# Altium project 3Phase_Power_Meter.PrjPcb
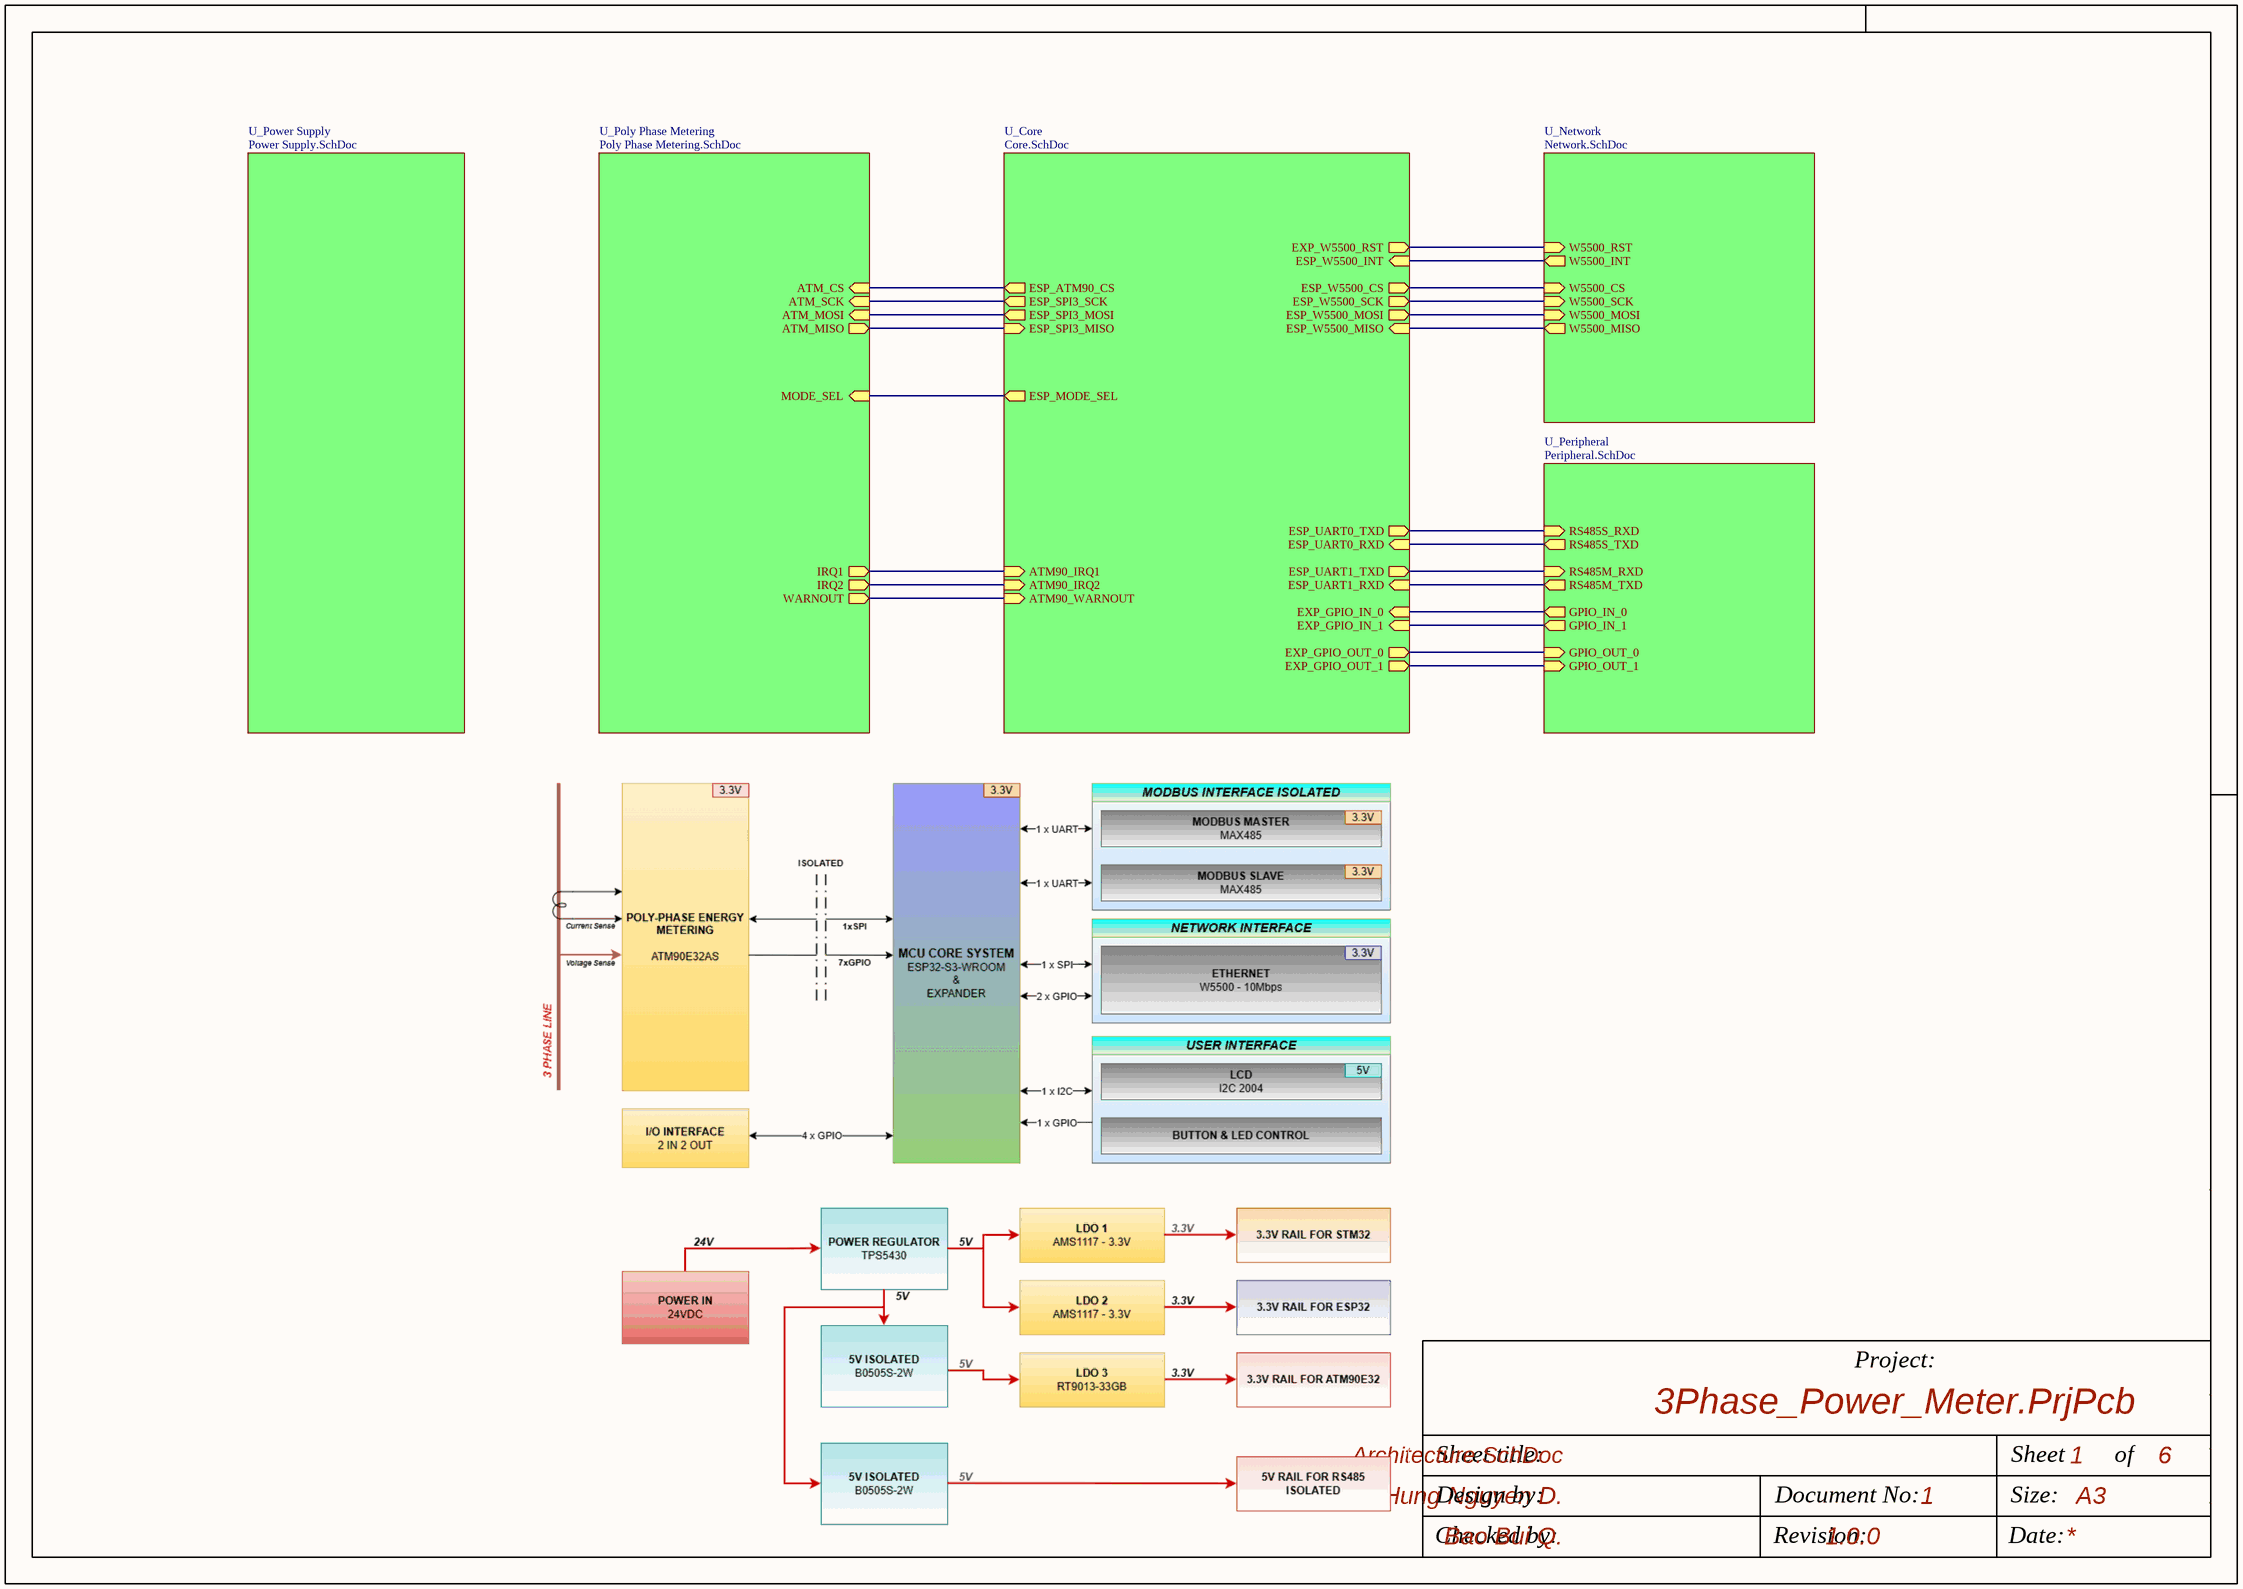
[diagram p0: Architecture.SchDoc]
6 sheets, 303 parts. Net scope: hierarchical (ports join the sheet entries above them; power ports are global).
Board file: PCB.PcbDoc
Sheets:
  Architecture.SchDoc
    U_Network = Network.SchDoc
    U_Peripheral = Peripheral.SchDoc
    U_Poly Phase Metering = Poly Phase Metering.SchDoc
    U_Power Supply = Power Supply.SchDoc
    U_Core = Core.SchDoc

## Sheet Architecture.SchDoc
size 420 x 297 mm; CheckedBy: Bao Bui Q.; Engineer: Hung Nguyen D.; Revision: 1.0.0; SheetNumber: 1; SheetTotal: 6

### Sub-sheets
U_Core = Core.SchDoc: ESP_SPI3_SCK (out), ESP_SPI3_MOSI (out), ESP_W5500_CS (out), ESP_SPI3_MISO (in), ESP_UART0_TXD (out), ESP_ATM90_CS (out), ESP_UART0_RXD (in), ESP_UART1_TXD (out), ESP_UART1_RXD (in), EXP_W5500_RST (out), ESP_W5500_INT (in), EXP_GPIO_IN_0 (in), EXP_GPIO_IN_1 (in), EXP_GPIO_OUT_0 (out), EXP_GPIO_OUT_1 (out), ATM90_IRQ1 (in), ATM90_IRQ2 (in), ATM90_WARNOUT (in), ESP_W5500_MISO (in), ESP_W5500_MOSI (out), ESP_W5500_SCK (out), ESP_MODE_SEL (out)
U_Network = Network.SchDoc: W5500_RST (in), W5500_INT (out), W5500_SCK (in), W5500_MOSI (in), W5500_MISO (out), W5500_CS (in)
U_Peripheral = Peripheral.SchDoc: RS485M_RXD (in), RS485M_TXD (out), RS485S_RXD (in), RS485S_TXD (out), GPIO_IN_0 (out), GPIO_OUT_0 (in), GPIO_IN_1 (out), GPIO_OUT_1 (in)
U_Poly Phase Metering = Poly Phase Metering.SchDoc: IRQ1 (out), IRQ2 (out), WARNOUT (out), ATM_CS (in), ATM_SCK (in), ATM_MOSI (in), ATM_MISO (out), MODE_SEL (in)
U_Power Supply = Power Supply.SchDoc: no entries

### Nets
ESP_SPI3_MISO: sheet U_Poly Phase Metering/ATM_MISO, sheet U_Core/ESP_SPI3_MISO
ESP_SPI3_MOSI: sheet U_Poly Phase Metering/ATM_MOSI, sheet U_Core/ESP_SPI3_MOSI
ESP_SPI3_SCK: sheet U_Poly Phase Metering/ATM_SCK, sheet U_Core/ESP_SPI3_SCK
W5500_RST: sheet U_Network/W5500_RST, sheet U_Core/EXP_W5500_RST
NetQ1_1: sheet U_Poly Phase Metering/MODE_SEL, sheet U_Core/ESP_MODE_SEL
NetQ2_1: sheet U_Peripheral/GPIO_OUT_0, sheet U_Core/EXP_GPIO_OUT_0
NetQ3_1: sheet U_Peripheral/GPIO_OUT_1, sheet U_Core/EXP_GPIO_OUT_1
NetR61_1: sheet U_Poly Phase Metering/IRQ1, sheet U_Core/ATM90_IRQ1
NetR63_1: sheet U_Poly Phase Metering/IRQ2, sheet U_Core/ATM90_IRQ2
NetR65_1: sheet U_Poly Phase Metering/WARNOUT, sheet U_Core/ATM90_WARNOUT
NetR90_1: sheet U_Peripheral/RS485S_RXD, sheet U_Core/ESP_UART0_TXD
NetR92_1: sheet U_Peripheral/RS485S_TXD, sheet U_Core/ESP_UART0_RXD
NetR94_1: sheet U_Peripheral/RS485M_RXD, sheet U_Core/ESP_UART1_TXD
NetR95_1: sheet U_Peripheral/RS485M_TXD, sheet U_Core/ESP_UART1_RXD
NetR96_2: sheet U_Network/W5500_SCK, sheet U_Core/ESP_W5500_SCK
NetR97_2: sheet U_Network/W5500_MOSI, sheet U_Core/ESP_W5500_MOSI
NetR98_2: sheet U_Network/W5500_MISO, sheet U_Core/ESP_W5500_MISO
NetR99_2: sheet U_Network/W5500_CS, sheet U_Core/ESP_W5500_CS
NetR100_2: sheet U_Network/W5500_INT, sheet U_Core/ESP_W5500_INT
NetR123_1: sheet U_Peripheral/GPIO_IN_0, sheet U_Core/EXP_GPIO_IN_0
NetR126_1: sheet U_Peripheral/GPIO_IN_1, sheet U_Core/EXP_GPIO_IN_1
NetU5_31: sheet U_Poly Phase Metering/ATM_CS, sheet U_Core/ESP_ATM90_CS

### Notes on the sheet
- Project:
- Sheet title:
- Sheet
- of
- Design by:
- Document No:
- Size:
- A3
- Checked by:
- Revision:
- Date:

## Sheet Network.SchDoc
size 420 x 297 mm; CheckedBy: Bao Bui Q; Engineer: Hung Nguyen D.; Revision: 1.0.0; SheetNumber: 6; SheetTotal: 6
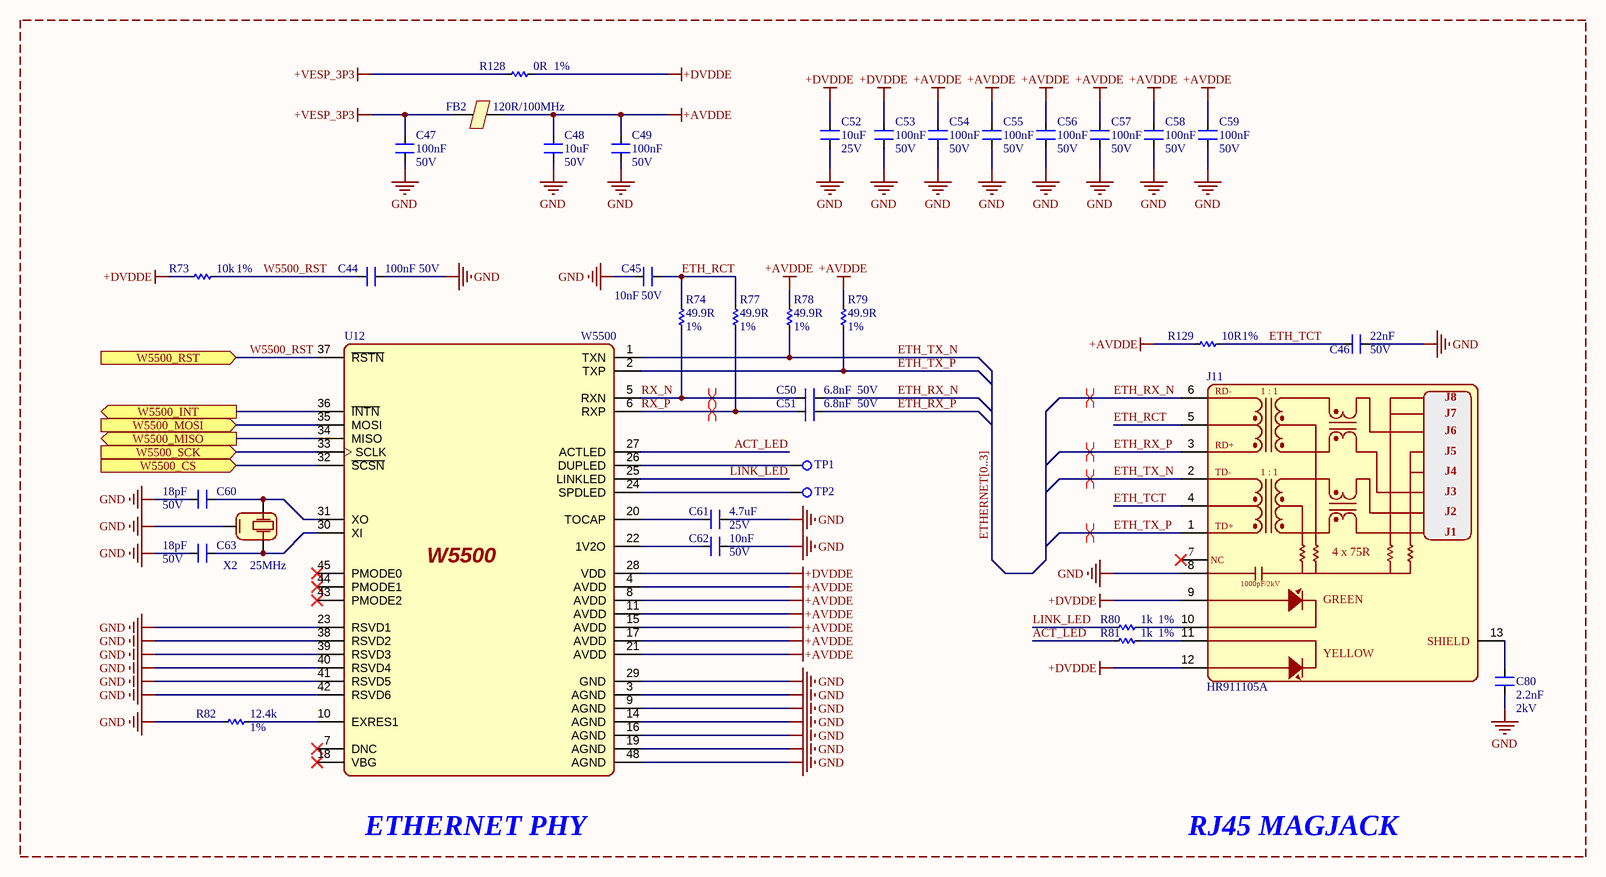
[diagram p1: Network.SchDoc]

### Parts
C44  Rating: 50V  [CAP_SMD_0603]  (hidden comment: 100nF)
C45  Rating: 50V  [CAP_SMD_0603]  (hidden comment: 10nF)
C46  Rating: 50V  [CAP_SMD_0603]  (hidden comment: 22nF)
C47  Rating: 50V  [CAP_SMD_0805]  (hidden comment: 100nF)
C48  Rating: 50V  [CAP_SMD_0603]  (hidden comment: 10uF)
C49  Rating: 50V  [CAP_SMD_0603]  (hidden comment: 100nF)
C50  Rating: 50V  [CAP_SMD_0603]  (hidden comment: 6.8nF)
C51  Rating: 50V  [CAP_SMD_0603]  (hidden comment: 6.8nF)
C52  Rating: 25V  [CAP_SMD_0805]  (hidden comment: 10uF)
C53  Rating: 50V  [CAP_SMD_0805]  (hidden comment: 100nF)
C54  Rating: 50V  [CAP_SMD_0603]  (hidden comment: 100nF)
C55  Rating: 50V  [CAP_SMD_0603]  (hidden comment: 100nF)
C56  Rating: 50V  [CAP_SMD_0603]  (hidden comment: 100nF)
C57  Rating: 50V  [CAP_SMD_0603]  (hidden comment: 100nF)
C58  Rating: 50V  [CAP_SMD_0603]  (hidden comment: 100nF)
C59  Rating: 50V  [CAP_SMD_0603]  (hidden comment: 100nF)
C60  Rating: 50V  [CAP_SMD_0805]  (hidden comment: 18pF)
C61  Rating: 25V  [CAP_SMD_0603]  (hidden comment: 4.7uF)
C62  Rating: 50V  [CAP_SMD_0603]  (hidden comment: 10nF)
C63  Rating: 50V  [CAP_SMD_0805]  (hidden comment: 18pF)
C80  Rating: 2kV  [CAP_SMD_1206]  (hidden comment: 2.2nF)
FB2  120R/100MHz  [Ferrite-0805]
J11  HR911105A  [HR911105A]
R73  Tolerance: 1%  [RES_SMD_0603]  (hidden comment: 10k)
R74  Tolerance: 1%  [RES_SMD_0603]  (hidden comment: 49.9R)
R77  Tolerance: 1%  [RES_SMD_0603]  (hidden comment: 49.9R)
R78  Tolerance: 1%  [RES_SMD_0603]  (hidden comment: 49.9R)
R79  Tolerance: 1%  [RES_SMD_0603]  (hidden comment: 49.9R)
R80  Tolerance: 1%  [RES_SMD_0603]  (hidden comment: 1k)
R81  Tolerance: 1%  [RES_SMD_0603]  (hidden comment: 1k)
R82  Tolerance: 1%  [RES_SMD_0603]  (hidden comment: 12.4k)
R128  Tolerance: 1%  [RES_SMD_0805]  (hidden comment: 0R)
R129  Tolerance: 1%  [RES_SMD_0603]  (hidden comment: 10R)
TP1  Test_Point  [PAD-SMD-D1.0]  (value not drawn)
TP2  Test_Point  [PAD-SMD-D1.0]  (value not drawn)
U12  W5500  [LQFP-48(7x7)]
X2  25MHz  [XT4-3225]

### Ports
W5500_CS (in, see Architecture[5A]), W5500_INT (out, see Architecture[5A]), W5500_MISO (out, see Architecture[5A]), W5500_MOSI (in, see Architecture[5A]), W5500_RST (in, see Architecture[5A]), W5500_SCK (in, see Architecture[5A])

### Nets
+AVDDE: C48.1 C49.1 C54.1 C55.1 C56.1 C57.1 C58.1 C59.1 FB2.2 R78.2 R79.2 R129.1 U12.4(AVDD) U12.8(AVDD) U12.11(AVDD) U12.15(AVDD) U12.17(AVDD) U12.21(AVDD)
+DVDDE: C52.1 C53.1 J11.9 J11.12 R73.1 R128.2 U12.28(VDD)
+VESP_3P3: C47.1 FB2.1 R128.1
GND: C44.1 C45.2 C46.1 C47.2 C48.2 C49.2 C52.2 C53.2 C54.2 C55.2 C56.2 C57.2 C58.2 C59.2 C60.2 C61.1 C62.1 C63.2 C80.2 J11.8 R82.2 U12.3(AGND) U12.9(AGND) U12.14(AGND) U12.16(AGND) U12.19(AGND) U12.23(RSVD1) U12.29(GND) U12.38(RSVD2) U12.39(RSVD3) U12.40(RSVD4) U12.41(RSVD5) U12.42(RSVD6) U12.48(AGND) X2.2,4(GND)
ACT_LED: R81.2 U12.27(ACTLED)
ETH_RCT: C45.1 J11.5 R74.2 R77.2
ETH_RX_N: C50.1 J11.6
ETH_RX_P: C51.1 J11.3
ETH_TCT: C46.2 J11.4 R129.2
ETH_TX_N: J11.2 R78.1 U12.1(TXN)
ETH_TX_P: J11.1 R79.1 U12.2(TXP)
LINK_LED: R80.2 U12.25(LINKLED)
RX_N: C50.2 R74.1 U12.5(RXN)
RX_P: C51.2 R77.1 U12.6(RXP)
W5500_RST: C44.2 R73.2 U12.37(~{RSTN}) ; port W5500_RST
NetC60_1: C60.1 U12.31(XO) X2.1(XTAL)
NetC61_2: C61.2 U12.20(TOCAP)
NetC62_2: C62.2 U12.22(1V2O)
NetC63_1: C63.1 U12.30(XI) X2.3(XTAL)
NetC80_1: C80.1 J11.13(SHIELD)
NetJ11_10: J11.10 R80.1
NetJ11_11: J11.11 R81.1
NetR82_1: R82.1 U12.10(EXRES1)
NetR96_2: U12.33(SCLK) ; port W5500_SCK
NetR97_2: U12.35(MOSI) ; port W5500_MOSI
NetR98_2: U12.34(MISO) ; port W5500_MISO
NetR99_2: U12.32(~{SCSN}) ; port W5500_CS
NetR100_2: U12.36(~{INTN}) ; port W5500_INT
NetTP1_1: TP1.1 U12.26(DUPLED)
NetTP2_1: TP2.1 U12.24(SPDLED)

Not connected (* = marked no-connect by the designer): J11 7(NC)*; U12 7(DNC)* 18(VBG)* 43(PMODE2)* 44(PMODE1)* 45(PMODE0)*

### Buses and harness runs
bus ETHERNET[0..3]

### Layout directives
differential pair; differential pair class ETH 100R: ETH_RX_N, ETH_RX_P, ETH_TX_N, ETH_TX_P, RX_N, RX_P

### Notes on the sheet
- (near U12) ETHERNET PHY
- RJ45 MAGJACK
- Project:
- Sheet title:
- Sheet
- of
- Design by:
- Document No:
- Size:
- A3
- Checked by:
- Revision:
- Date:
- (in symbol RJ45_10/100) RD-; 1 : 1; J8; J7; J6; RD+; J5; TD-; J4; J3; J2; TD+; J1; 4 x 75R; 1000pF/2kV; GREEN; YELLOW

### Library data of the parts
C44-C63 C80 = CN: PN: *; LCSC: *
  C44 C47 C49 C53-C59: Value: 100nF
  C45 C62: Value: 10nF
  C46: Value: 22nF
  C48 C52: Value: 10uF
  C50 C51: Value: 6.8nF
  C60 C63: Value: 18pF
  C61: Value: 4.7uF
  C80: Value: 2.2nF
FB2 = FERRITE BEAD: PN: CBW201209U121T; LCSC: C139186; Value: 120R/100MHz
J11 = RJ45_10/100: PN: HR911105A; LCSC: C12074; Value: HR911105A
R73 R74 R77-R82 R128 R129 = Res-SMD: Resistor; PN: *; LCSC: *
  R73: Value: 10k
  R74 R77-R79: Value: 49.9R
  R80 R81: Value: 1k
  R82: Value: 12.4k
  R128: Value: 0R
  R129: Value: 10R
U12 = W5500: -40℃~+85℃ 10BASE-T、100BASE-TX 3.3V 32KB 8 SPI SPI Yes LQFP-48(7x7) Ethernet Controllers ROHS; PN: W5500; LCSC: C32843; Value: W5500
X2 = XT4: Crystal, 16 MHz, -30 to 85 degC, 3.2 x 2.5 x 0.9 mm SMD; PN: *; LCSC: *; Value: 25MHz

## Sheet Peripheral.SchDoc
size 420 x 297 mm; CheckedBy: Bao Bui Q.; Engineer: Hung Nguyen D.; Revision: 1.0.0; SheetNumber: 5; SheetTotal: 6
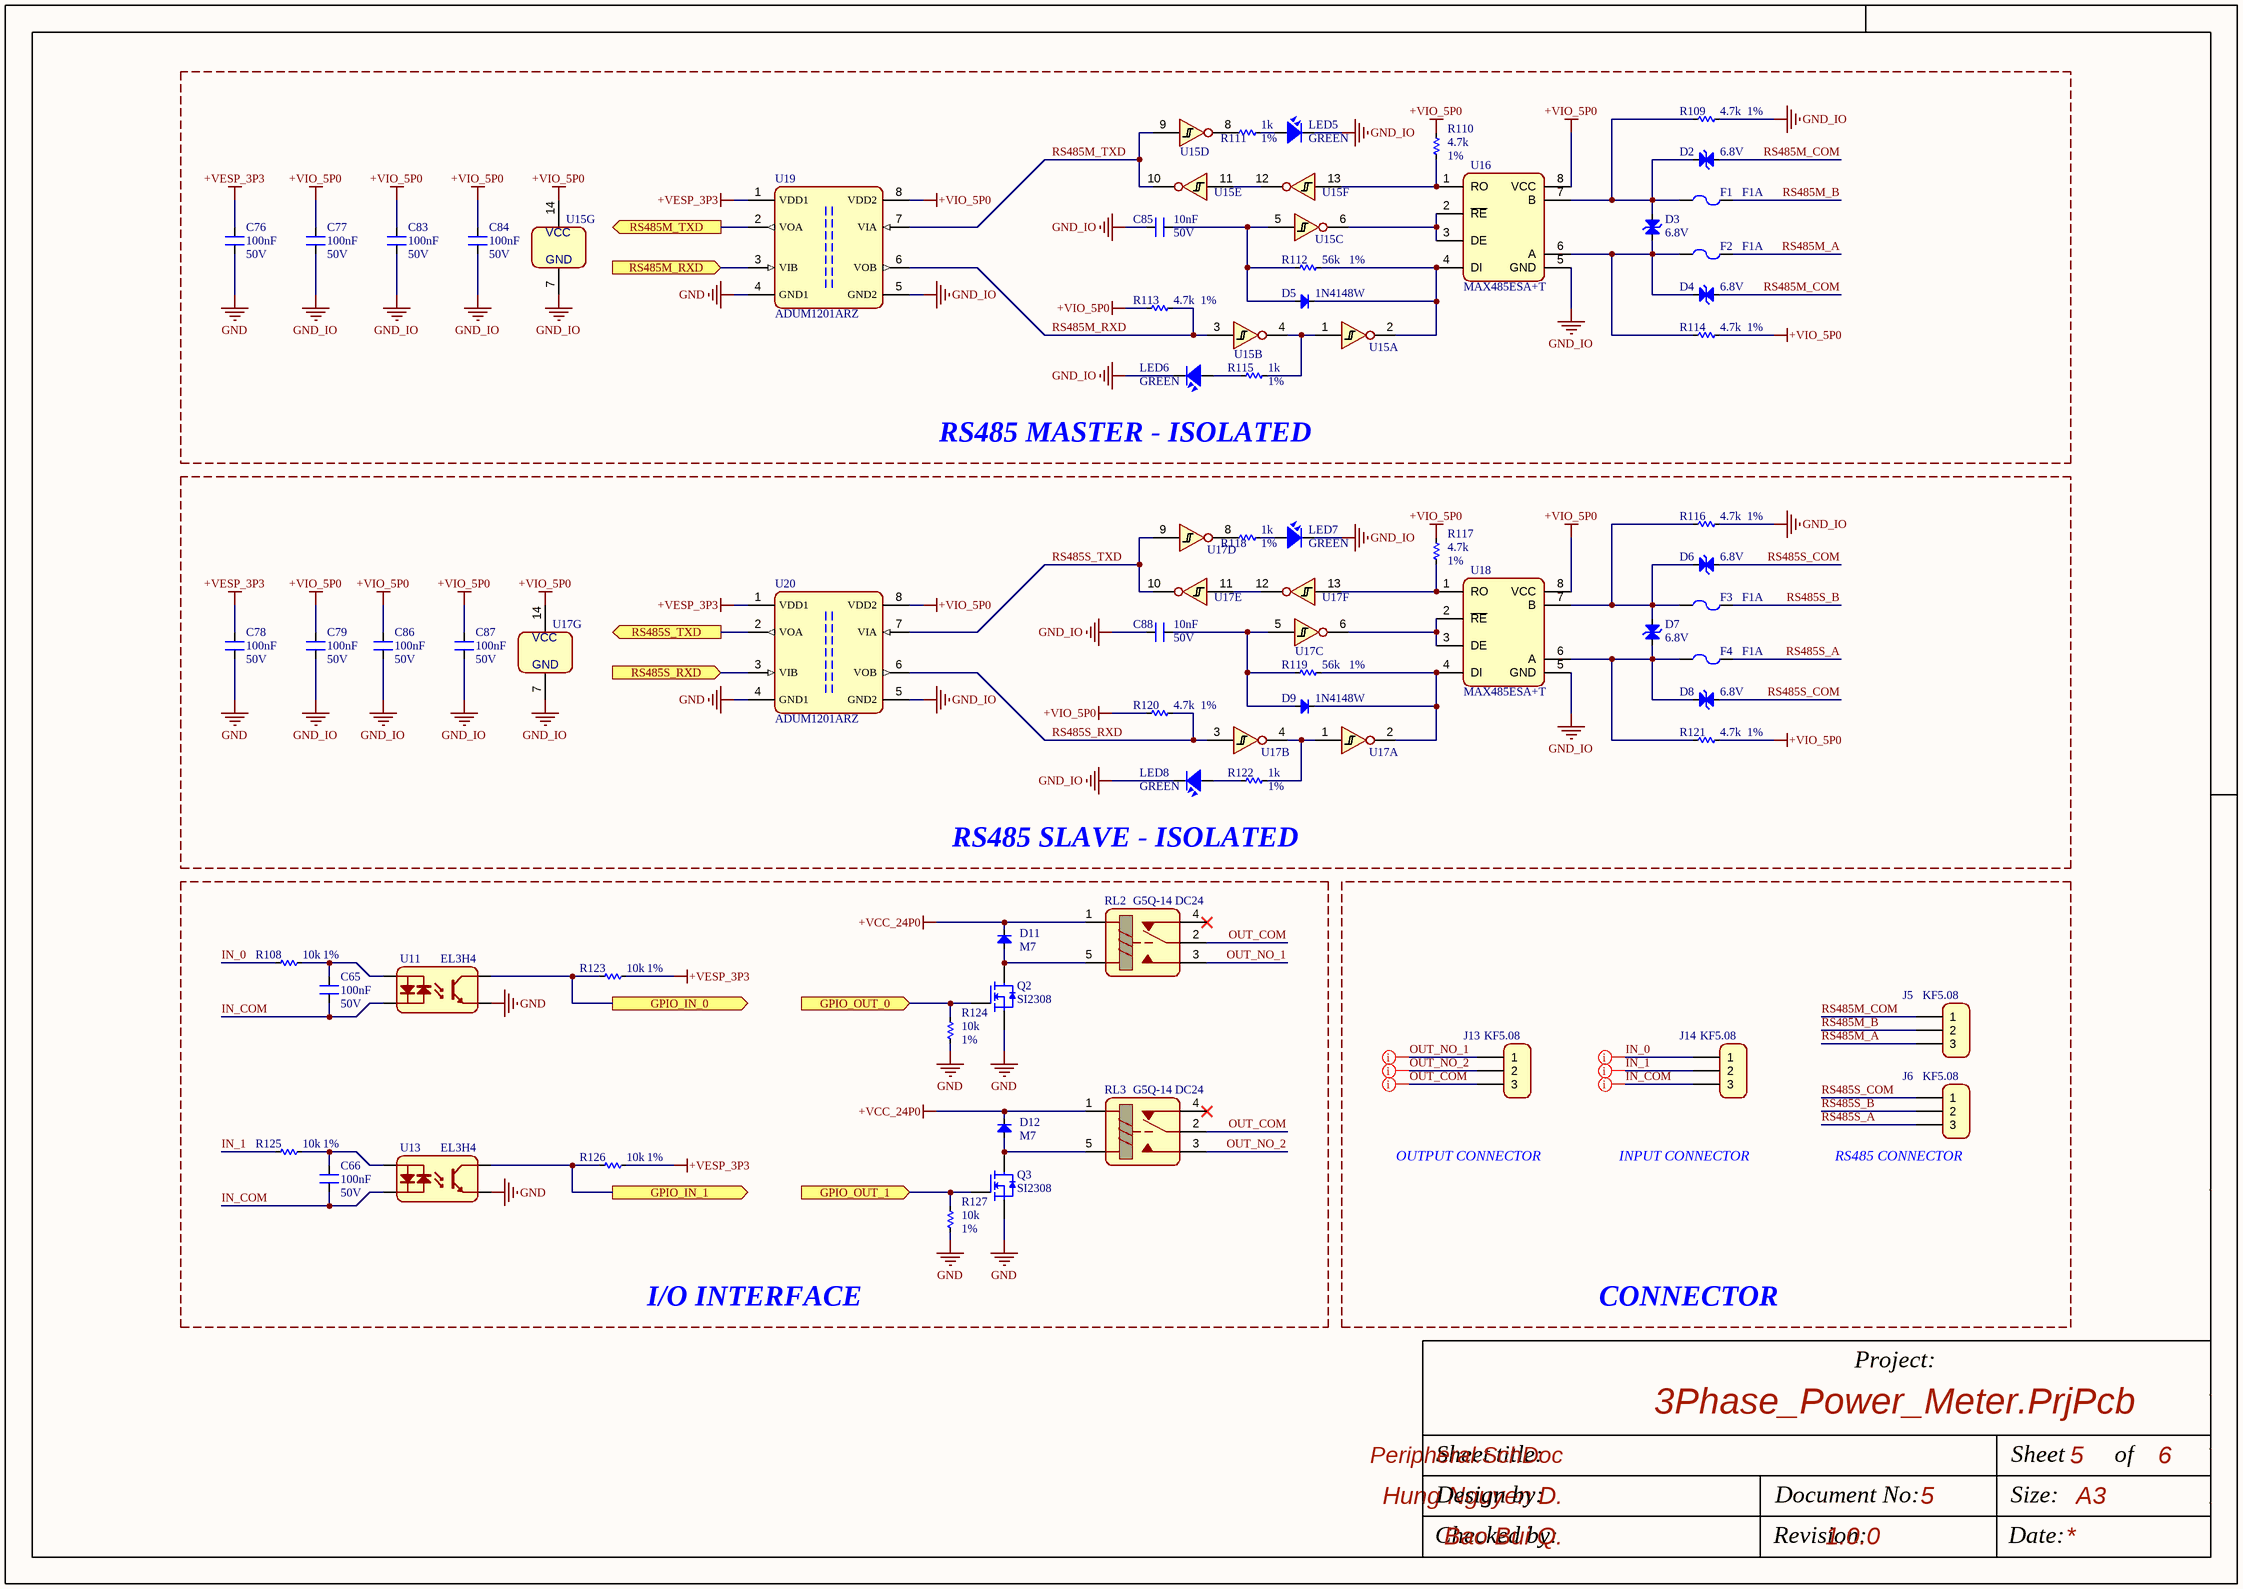
[diagram p2: Peripheral.SchDoc]

### Parts
C65  Rating: 50V  [CAP_SMD_0603]  (hidden comment: 100nF)
C66  Rating: 50V  [CAP_SMD_0603]  (hidden comment: 100nF)
C76  Rating: 50V  [CAP_SMD_0603]  (hidden comment: 100nF)
C77  Rating: 50V  [CAP_SMD_0603]  (hidden comment: 100nF)
C78  Rating: 50V  [CAP_SMD_0603]  (hidden comment: 100nF)
C79  Rating: 50V  [CAP_SMD_0603]  (hidden comment: 100nF)
C83  Rating: 50V  [CAP_SMD_0603]  (hidden comment: 100nF)
C84  Rating: 50V  [CAP_SMD_0603]  (hidden comment: 100nF)
C85  Rating: 50V  [CAP_SMD_0603]  (hidden comment: 10nF)
C86  Rating: 50V  [CAP_SMD_0603]  (hidden comment: 100nF)
C87  Rating: 50V  [CAP_SMD_0603]  (hidden comment: 100nF)
C88  Rating: 50V  [CAP_SMD_0603]  (hidden comment: 10nF)
D2  6.8V  [SOD123FL]
D3  6.8V  [SOD123FL]
D4  6.8V  [SOD123FL]
D5  1N4148W  [SOD323]
D6  6.8V  [SOD123FL]
D7  6.8V  [SOD123FL]
D8  6.8V  [SOD123FL]
D9  1N4148W  [SOD323]
D11  M7  [DIO-SMD-A]
D12  M7  [DIO-SMD-A]
F1  F1A  [FUSE_1812]
F2  F1A  [FUSE_1812]
F3  F1A  [FUSE_1812]
F4  F1A  [FUSE_1812]
J5  KF5.08  [KF3-5.08X]
J6  KF5.08  [KF3-5.08X]
J13  KF5.08  [KF3-5.08X]
J14  KF5.08  [KF3-5.08X]
LED5  GREEN  [GREENLED_0603]
LED6  GREEN  [GREENLED_0603]
LED7  GREEN  [GREENLED_0603]
LED8  GREEN  [GREENLED_0603]
Q2  SI2308  [SOT23-123]
Q3  SI2308  [SOT23-123]
R108  Tolerance: 1%  [RES_SMD_0603]  (hidden comment: 10k)
R109  Tolerance: 1%  [RES_SMD_0603]  (hidden comment: 4.7k)
R110  Tolerance: 1%  [RES_SMD_0603]  (hidden comment: 4.7k)
R111  Tolerance: 1%  [RES_SMD_0603]  (hidden comment: 1k)
R112  Tolerance: 1%  [RES_SMD_0603]  (hidden comment: 56k)
R113  Tolerance: 1%  [RES_SMD_0603]  (hidden comment: 4.7k)
R114  Tolerance: 1%  [RES_SMD_0603]  (hidden comment: 4.7k)
R115  Tolerance: 1%  [RES_SMD_0603]  (hidden comment: 1k)
R116  Tolerance: 1%  [RES_SMD_0603]  (hidden comment: 4.7k)
R117  Tolerance: 1%  [RES_SMD_0603]  (hidden comment: 4.7k)
R118  Tolerance: 1%  [RES_SMD_0603]  (hidden comment: 1k)
R119  Tolerance: 1%  [RES_SMD_0603]  (hidden comment: 56k)
R120  Tolerance: 1%  [RES_SMD_0603]  (hidden comment: 4.7k)
R121  Tolerance: 1%  [RES_SMD_0603]  (hidden comment: 4.7k)
R122  Tolerance: 1%  [RES_SMD_0603]  (hidden comment: 1k)
R123  Tolerance: 1%  [RES_SMD_0603]  (hidden comment: 10k)
R124  Tolerance: 1%  [RES_SMD_0603]  (hidden comment: 10k)
R125  Tolerance: 1%  [RES_SMD_0603]  (hidden comment: 10k)
R126  Tolerance: 1%  [RES_SMD_0603]  (hidden comment: 10k)
R127  Tolerance: 1%  [RES_SMD_0603]  (hidden comment: 10k)
RL2  G5Q-14 DC24  [RELAY-G5Q-14]
RL3  G5Q-14 DC24  [RELAY-G5Q-14]
U11  EL3H4  [SOIC-4-175mil]
U13  EL3H4  [SOIC-4-175mil]
U15  SN74HC14DR  [SOIC-14]  (value not drawn)  (parts A,B,C,D,E,F,G of 7)
U16  MAX485ESA+T  [SOIC-8]
U17  SN74HC14DR  [SOIC-14]  (value not drawn)  (parts A,B,C,D,E,F,G of 7)
U18  MAX485ESA+T  [SOIC-8]
U19  ADUM1201ARZ  [SOIC-8]
U20  ADUM1201ARZ  [SOIC-8]

### Blocks framed on the sheet
RS485 MASTER - ISOLATED: C76 C77 C83-C85 D2-D5 F1 F2 LED5 LED6 R109-R115 U15 U16 U19
RS485 SLAVE - ISOLATED: C78 C79 C86-C88 D6-D9 F3 F4 LED7 LED8 R116-R122 U17 U18 U20
I/O INTERFACE: C65 C66 D11 D12 Q2 Q3 R108 R123-R127 RL2 RL3 U11 U13
CONNECTOR: J5 J6 J13 J14

### Ports
GPIO_IN_0 (out, see Architecture[5B]), GPIO_IN_1 (out, see Architecture[5B]), GPIO_OUT_0 (in, see Architecture[5B]), GPIO_OUT_1 (in, see Architecture[5B]), RS485M_RXD (in, see Architecture[5B]), RS485M_TXD (out, see Architecture[5B]), RS485S_RXD (in, see Architecture[5B]), RS485S_TXD (out, see Architecture[5B])

### Nets
+VCC_24P0: D11.2(K) D12.2(K) RL2.1(COIL) RL3.1(COIL)
+VESP_3P3: C76.1 C78.1 R123.2 R126.2 U19.1(VDD1) U20.1(VDD1)
+VIO_5P0: C77.1 C79.1 C83.1 C84.1 C86.1 C87.1 R110.1 R113.2 R114.1 R117.1 R120.2 R121.1 U15.14(VCC) U16.8(VCC) U17.14(VCC) U18.8(VCC) U19.8(VDD2) U20.8(VDD2)
GND: C76.2 C78.2 Q2.2 Q3.2 R124.2 R127.2 U11.3(E) U13.3(E) U19.4(GND1) U20.4(GND1)
GND_IO: C77.2 C79.2 C83.2 C84.2 C85.2 C86.2 C87.2 C88.2 LED5.2 LED6.2 LED7.2 LED8.2 R109.1 R116.1 U15.7(GND) U16.5(GND) U17.7(GND) U18.5(GND) U19.5(GND2) U20.5(GND2)
IN_0: J14.1 R108.1
IN_1: J14.2 R125.1
IN_COM: C65.2 C66.2 J14.3 U11.2(AC) U13.2(AC)
OUT_COM: J13.3 RL2.2(COM) RL3.2(COM)
OUT_NO_1: J13.1 RL2.3
OUT_NO_2: J13.2 RL3.3
RS485M_A: F2.2 J5.3
RS485M_B: F1.2 J5.2
RS485M_COM: D2.2 D4.2 J5.1
RS485M_RXD: R113.1 U15.3(A) U19.6(VOB)
RS485M_TXD: U15.9(A) U15.10(Y) U19.7(VIA)
RS485S_A: F4.2 J6.3
RS485S_B: F3.2 J6.2
RS485S_COM: D6.2 D8.2 J6.1
RS485S_RXD: R120.1 U17.3(A) U20.6(VOB)
RS485S_TXD: U17.9(A) U17.10(Y) U20.7(VIA)
NetC65_1: C65.1 R108.2 U11.1(AC)
NetC66_1: C66.1 R125.2 U13.1(AC)
NetC85_1: C85.1 D5.1(A) R112.2 U15.5(A)
NetC88_1: C88.1 D9.1(A) R119.2 U17.5(A)
NetD2_1: D2.1 D3.1 F1.1 R109.2 U16.7(B)
NetD3_2: D3.2 D4.1 F2.1 R114.2 U16.6(A)
NetD5_2: D5.2(K) R112.1 U15.2(Y) U16.4(DI)
NetD6_1: D6.1 D7.1 F3.1 R116.2 U18.7(B)
NetD7_2: D7.2 D8.1 F4.1 R121.2 U18.6(A)
NetD9_2: D9.2(K) R119.1 U17.2(Y) U18.4(DI)
NetD11_1: D11.1(A) Q2.3 RL2.5(COIL)
NetD12_1: D12.1(A) Q3.3 RL3.5(COIL)
NetLED5_1: LED5.1 R111.2
NetLED6_1: LED6.1 R115.1
NetLED7_1: LED7.1 R118.2
NetLED8_1: LED8.1 R122.1
NetQ2_1: Q2.1 R124.1 ; port GPIO_OUT_0
NetQ3_1: Q3.1 R127.1 ; port GPIO_OUT_1
NetR90_1: U20.3(VIB) ; port RS485S_RXD
NetR92_1: U20.2(VOA) ; port RS485S_TXD
NetR94_1: U19.3(VIB) ; port RS485M_RXD
NetR95_1: U19.2(VOA) ; port RS485M_TXD
NetR110_2: R110.2 U15.13(A) U16.1(RO)
NetR111_1: R111.1 U15.8(Y)
NetR115_2: R115.2 U15.1(A) U15.4(Y)
NetR117_2: R117.2 U17.13(A) U18.1(RO)
NetR118_1: R118.1 U17.8(Y)
NetR122_2: R122.2 U17.1(A) U17.4(Y)
NetR123_1: R123.1 U11.4(C) ; port GPIO_IN_0
NetR126_1: R126.1 U13.4(C) ; port GPIO_IN_1
NetU15_6: U15.6(Y) U16.2(~{RE}) U16.3(DE)
NetU15_11: U15.11(A) U15.12(Y)
NetU17_6: U17.6(Y) U18.2(~{RE}) U18.3(DE)
NetU17_11: U17.11(A) U17.12(Y)

Not connected (* = marked no-connect by the designer): RL2 4(NC)*; RL3 4(NC)*

### Layout directives
net class HV_SIG: IN_0, IN_1, IN_COM, OUT_COM, OUT_NO_1, OUT_NO_2

### Notes on the sheet
- OUTPUT CONNECTOR
- INPUT CONNECTOR
- (near J6) RS485 CONNECTOR
- Project:
- Sheet title:
- Sheet
- of
- Design by:
- Document No:
- Size:
- A3
- Checked by:
- Revision:
- Date:

### Library data of the parts
C65 C66 C76-C79 C83-C88 = CN: PN: *; LCSC: *
  C65 C66 C76-C79 C83 C84 C86 C87: Value: 100nF
  C85 C88: Value: 10nF
D2-D4 D6-D8 = TVS DIODE: PN: *; LCSC: *; Value: 6.8V
D5 D9 D11 D12 = Diode SMD: Default Diode; LCSC: *; PN: *
  D5 D9: Value: 1N4148W
  D11 D12: Value: M7
F1-F4 = Fuse: Designed by: VanDungEvn; Value: Fuse
J5 J6 J13 J14 = KF3: ComponentLink1 Description: Manufacturer; ComponentLink2 Description: Datasheet; ComponentLink1URL: http://www.we-online.com; ComponentLink2URL: http://katalog.we-online.de/em/datasheet/6911031100xx.pdf; PN: *; LCSC: *; Value: KF5.08
LED5-LED8 = LED SMD: PN: *; LCSC: *; Value: GREEN
Q2 Q3 = FET-N: PN: *; LCSC: *; Value: SI2308
R108-R127 = Res-SMD: Resistor; PN: *; LCSC: *
  R108 R123-R127: Value: 10k
  R109 R110 R113 R114 R116 R117 R120 R121: Value: 4.7k
  R111 R115 R118 R122: Value: 1k
  R112 R119: Value: 56k
RL2 RL3 = Relay 5: Relay SPDT,10A - 12VDC 5 Pin; PN: G5Q-14 DC24; LCSC: C397242; Value: G5Q-14 DC24
U11 U13 = OPTO_AC: AC,DC Integrated anti-parallel LED Phototransistor; PN: EL3H4(A)(TA)-VG; LCSC: C42384997; Value: EL3H4
U15 U17 = 74HC14: -40℃~+85℃ 1 1.5V~4.2V 21ns@6V,50pF 2V~6V 2uA 300mV~1.2V 5.2mA 5.2mA 6 74HC Series Schmitt trigger SOIC-14 Inverters ROHS; Value: SN74HC14DR; PN: SN74HC14DR; LCSC: C6820
U16 U18 = MAX485: -40℃~+85℃ 1 1 2.5Mbps 4.75V~5.25V Transceiver SOIC-8 RS-485 / RS-422 ICs ROHS; PN: MAX485ESA+T; LCSC: C19738; Value: MAX485ESA+T
U19 U20 = ADUM1201: -40℃~+105℃ 1 1 1Mbps 2.7V~5.5V 2.7V~5.5V 2500 25kV/us 50ns Bidirectional signal isolation、Multi-voltage domain interface、Power-on reset SOIC-8 Digital Isolators ROHS; PN: ADUM1201ARZ; LCSC: C9669; Value: ADUM1201ARZ

## Sheet Poly Phase Metering.SchDoc
size 420 x 297 mm; CheckedBy: Bao Bui Q.; Engineer: Hung Nguyen D.; Revision: 1.0.0; SheetNumber: 3; SheetTotal: 6
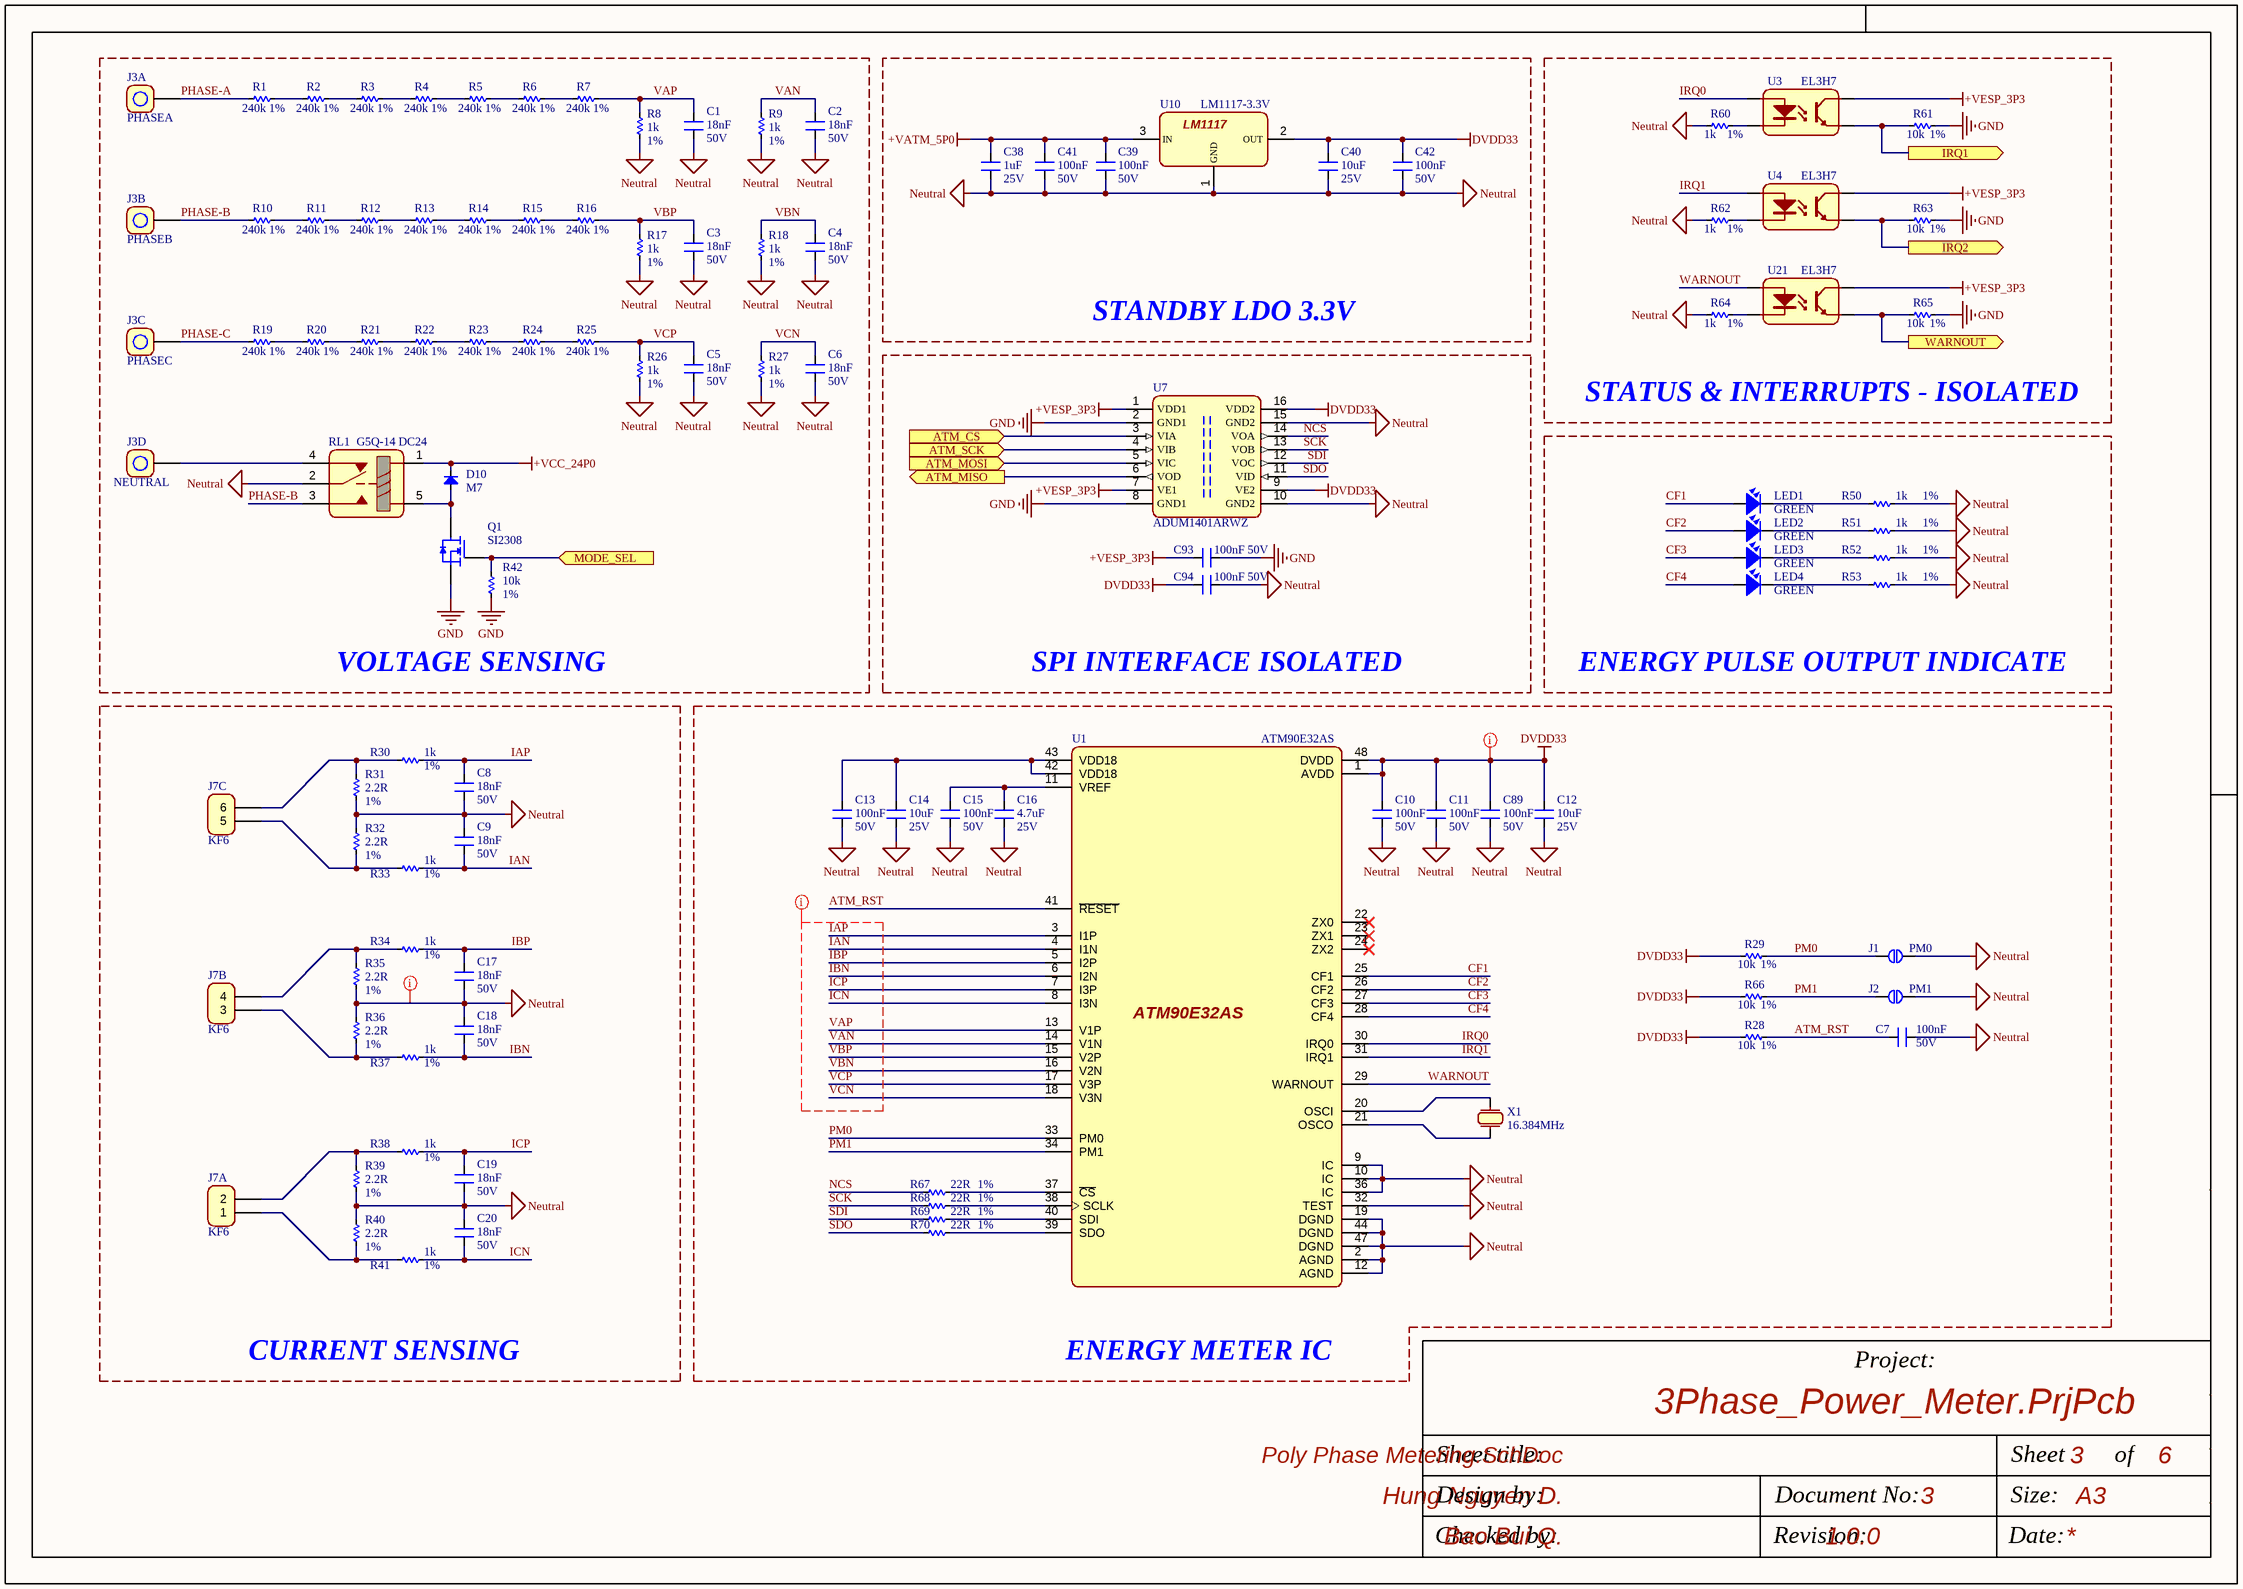
[diagram p3: Poly Phase Metering.SchDoc]

### Parts
C1  Rating: 50V  [CAP_SMD_0603]  (hidden comment: 18nF)
C2  Rating: 50V  [CAP_SMD_0603]  (hidden comment: 18nF)
C3  Rating: 50V  [CAP_SMD_0603]  (hidden comment: 18nF)
C4  Rating: 50V  [CAP_SMD_0603]  (hidden comment: 18nF)
C5  Rating: 50V  [CAP_SMD_0603]  (hidden comment: 18nF)
C6  Rating: 50V  [CAP_SMD_0603]  (hidden comment: 18nF)
C7  Rating: 50V  [CAP_SMD_0603]  (hidden comment: 100nF)
C8  Rating: 50V  [CAP_SMD_1206]  (hidden comment: 18nF)
C9  Rating: 50V  [CAP_SMD_1206]  (hidden comment: 18nF)
C10  Rating: 50V  [CAP_SMD_0603]  (hidden comment: 100nF)
C11  Rating: 50V  [CAP_SMD_0603]  (hidden comment: 100nF)
C12  Rating: 25V  [CAP_SMD_0603]  (hidden comment: 10uF)
C13  Rating: 50V  [CAP_SMD_0603]  (hidden comment: 100nF)
C14  Rating: 25V  [CAP_SMD_0603]  (hidden comment: 10uF)
C15  Rating: 50V  [CAP_SMD_0603]  (hidden comment: 100nF)
C16  Rating: 25V  [CAP_SMD_0603]  (hidden comment: 4.7uF)
C17  Rating: 50V  [CAP_SMD_1206]  (hidden comment: 18nF)
C18  Rating: 50V  [CAP_SMD_1206]  (hidden comment: 18nF)
C19  Rating: 50V  [CAP_SMD_1206]  (hidden comment: 18nF)
C20  Rating: 50V  [CAP_SMD_1206]  (hidden comment: 18nF)
C38  Rating: 25V  [CAP_SMD_1206]  (hidden comment: 1uF)
C39  Rating: 50V  [CAP_SMD_1206]  (hidden comment: 100nF)
C40  Rating: 25V  [CAP_SMD_1206]  (hidden comment: 10uF)
C41  Rating: 50V  [CAP_SMD_1206]  (hidden comment: 100nF)
C42  Rating: 50V  [CAP_SMD_1206]  (hidden comment: 100nF)
C89  Rating: 50V  [CAP_SMD_0603]  (hidden comment: 100nF)
C93  Rating: 50V  [CAP_SMD_0603]  (hidden comment: 100nF)
C94  Rating: 50V  [CAP_SMD_0603]  (hidden comment: 100nF)
D10  M7  [DIO-SMD-A]
J1  PM0  [SOLDER_JUMP_2_1mm]
J2  PM1  [SOLDER_JUMP_2_1mm]
J3  PHASEA  [KF7.62-7P]  (parts A,B,C,D of 4)
J7  KF6  [KF6-5.08X]  (parts A,B,C of 3)
LED1  GREEN  [GREENLED_0603]
LED2  GREEN  [GREENLED_0603]
LED3  GREEN  [GREENLED_0603]
LED4  GREEN  [GREENLED_0603]
Q1  SI2308  [SOT23-123]
R1  Tolerance: 1%  [RES_SMD_1206]  (hidden comment: 240k)
R2  Tolerance: 1%  [RES_SMD_1206]  (hidden comment: 240k)
R3  Tolerance: 1%  [RES_SMD_1206]  (hidden comment: 240k)
R4  Tolerance: 1%  [RES_SMD_1206]  (hidden comment: 240k)
R5  Tolerance: 1%  [RES_SMD_1206]  (hidden comment: 240k)
R6  Tolerance: 1%  [RES_SMD_1206]  (hidden comment: 240k)
R7  Tolerance: 1%  [RES_SMD_1206]  (hidden comment: 240k)
R8  Tolerance: 1%  [RES_SMD_0603]  (hidden comment: 1k)
R9  Tolerance: 1%  [RES_SMD_0603]  (hidden comment: 1k)
R10  Tolerance: 1%  [RES_SMD_1206]  (hidden comment: 240k)
R11  Tolerance: 1%  [RES_SMD_1206]  (hidden comment: 240k)
R12  Tolerance: 1%  [RES_SMD_1206]  (hidden comment: 240k)
R13  Tolerance: 1%  [RES_SMD_1206]  (hidden comment: 240k)
R14  Tolerance: 1%  [RES_SMD_1206]  (hidden comment: 240k)
R15  Tolerance: 1%  [RES_SMD_1206]  (hidden comment: 240k)
R16  Tolerance: 1%  [RES_SMD_1206]  (hidden comment: 240k)
R17  Tolerance: 1%  [RES_SMD_0603]  (hidden comment: 1k)
R18  Tolerance: 1%  [RES_SMD_0603]  (hidden comment: 1k)
R19  Tolerance: 1%  [RES_SMD_1206]  (hidden comment: 240k)
R20  Tolerance: 1%  [RES_SMD_1206]  (hidden comment: 240k)
R21  Tolerance: 1%  [RES_SMD_1206]  (hidden comment: 240k)
R22  Tolerance: 1%  [RES_SMD_1206]  (hidden comment: 240k)
R23  Tolerance: 1%  [RES_SMD_1206]  (hidden comment: 240k)
R24  Tolerance: 1%  [RES_SMD_1206]  (hidden comment: 240k)
R25  Tolerance: 1%  [RES_SMD_1206]  (hidden comment: 240k)
R26  Tolerance: 1%  [RES_SMD_0603]  (hidden comment: 1k)
R27  Tolerance: 1%  [RES_SMD_0603]  (hidden comment: 1k)
R28  Tolerance: 1%  [RES_SMD_0603]  (hidden comment: 10k)
R29  Tolerance: 1%  [RES_SMD_0603]  (hidden comment: 10k)
R30  Tolerance: 1%  [RES_SMD_1206]  (hidden comment: 1k)
R31  Tolerance: 1%  [RES_SMD_1206]  (hidden comment: 2.2R)
R32  Tolerance: 1%  [RES_SMD_1206]  (hidden comment: 2.2R)
R33  Tolerance: 1%  [RES_SMD_1206]  (hidden comment: 1k)
R34  Tolerance: 1%  [RES_SMD_1206]  (hidden comment: 1k)
R35  Tolerance: 1%  [RES_SMD_1206]  (hidden comment: 2.2R)
R36  Tolerance: 1%  [RES_SMD_1206]  (hidden comment: 2.2R)
R37  Tolerance: 1%  [RES_SMD_1206]  (hidden comment: 1k)
R38  Tolerance: 1%  [RES_SMD_1206]  (hidden comment: 1k)
R39  Tolerance: 1%  [RES_SMD_1206]  (hidden comment: 2.2R)
R40  Tolerance: 1%  [RES_SMD_1206]  (hidden comment: 2.2R)
R41  Tolerance: 1%  [RES_SMD_1206]  (hidden comment: 1k)
R42  Tolerance: 1%  [RES_SMD_0603]  (hidden comment: 10k)
R50  Tolerance: 1%  [RES_SMD_0603]  (hidden comment: 1k)
R51  Tolerance: 1%  [RES_SMD_0603]  (hidden comment: 1k)
R52  Tolerance: 1%  [RES_SMD_0603]  (hidden comment: 1k)
R53  Tolerance: 1%  [RES_SMD_0603]  (hidden comment: 1k)
R60  Tolerance: 1%  [RES_SMD_0603]  (hidden comment: 1k)
R61  Tolerance: 1%  [RES_SMD_0603]  (hidden comment: 10k)
R62  Tolerance: 1%  [RES_SMD_0603]  (hidden comment: 1k)
R63  Tolerance: 1%  [RES_SMD_0603]  (hidden comment: 10k)
R64  Tolerance: 1%  [RES_SMD_0603]  (hidden comment: 1k)
R65  Tolerance: 1%  [RES_SMD_0603]  (hidden comment: 10k)
R66  Tolerance: 1%  [RES_SMD_0603]  (hidden comment: 10k)
R67  Tolerance: 1%  [RES_SMD_0603]  (hidden comment: 22R)
R68  Tolerance: 1%  [RES_SMD_0603]  (hidden comment: 22R)
R69  Tolerance: 1%  [RES_SMD_0603]  (hidden comment: 22R)
R70  Tolerance: 1%  [RES_SMD_0603]  (hidden comment: 22R)
RL1  G5Q-14 DC24  [RELAY-G5Q-14]
U1  ATM90E32AS  [TQFP48]
U3  EL3H7  [SSOP-4-1.27mm]
U4  EL3H7  [SSOP-4-1.27mm]
U7  ADUM1401ARWZ  [SOIC-16-300mil]
U10  LM1117-3.3V  [SOT223-4]
U21  EL3H7  [SSOP-4-1.27mm]
X1  16.384MHz  [XT2-SMD]

### Blocks framed on the sheet
VOLTAGE SENSING: C1-C6 D10 J3 Q1 R1-R27 R42 RL1
STANDBY LDO 3.3V: C38-C42 U10
STATUS & INTERRUPTS - ISOLATED: R60-R65 U3 U4 U21
SPI INTERFACE ISOLATED: C93 C94 U7
ENERGY PULSE OUTPUT INDICATE: LED1-LED4 R50-R53
CURRENT SENSING: C8 C9 C17-C20 J7 R30-R41
ENERGY METER IC: C7 C10-C16 C89 J1 J2 R28 R29 R66-R70 U1 X1

### Ports
ATM_CS (in, see Architecture[3A]), ATM_MISO (out, see Architecture[3A]), ATM_MOSI (in, see Architecture[3A]), ATM_SCK (in, see Architecture[3A]), IRQ1 (out, see Architecture[3B]), IRQ2 (out, see Architecture[3B]), MODE_SEL (in, see Architecture[3A]), WARNOUT (out, see Architecture[3B])

### Nets
+VATM_5P0: C38.2 C39.2 C41.2 U10.3(IN)
+VCC_24P0: D10.2(K) RL1.1(COIL)
+VESP_3P3: C93.1 U3.4(C) U4.4(C) U7.1(VDD1) U7.7(VE1) U21.4(C)
DVDD33: C10.2 C11.2 C12.2 C40.2 C42.2 C89.2 C94.1 R28.1 R29.1 R66.1 U1.1(AVDD) U1.48(DVDD) U7.9(VE2) U7.16(VDD2) U10.2(OUT)
GND: C93.2 Q1.2 R42.2 R61.2 R63.2 R65.2 U7.2(GND1) U7.8(GND1)
Neutral: C1.1 C2.1 C3.1 C4.1 C5.1 C6.1 C7.1 C8.1 C9.2 C10.1 C11.1 C12.1 C13.1 C14.1 C15.1 C16.1 C17.1 C18.2 C19.1 C20.2 C38.1 C39.1 C40.1 C41.1 C42.1 C89.1 C94.2 J1.2 J2.2 R8.2 R9.2 R17.2 R18.2 R26.2 R27.2 R31.2 R32.1 R35.2 R36.1 R39.2 R40.1 R50.2 R51.2 R52.2 R53.2 R60.1 R62.1 R64.1 RL1.2(COM) U1.2(AGND) U1.9(IC) U1.10(IC) U1.12(AGND) U1.19(DGND) U1.32(TEST) U1.36(IC) U1.44(DGND) U1.47(DGND) U7.10(GND2) U7.15(GND2) U10.1(GND)
ATM_RST: C7.2 R28.2 U1.41(~{RESET})
CF1: LED1.1 U1.25(CF1)
CF2: LED2.1 U1.26(CF2)
CF3: LED3.1 U1.27(CF3)
CF4: LED4.1 U1.28(CF4)
ESP_SPI3_MISO: U7.6(VOD) ; port ATM_MISO
ESP_SPI3_MOSI: U7.5(VIC) ; port ATM_MOSI
ESP_SPI3_SCK: U7.4(VIB) ; port ATM_SCK
IAN: C9.1 R33.1 U1.4(I1N)
IAP: C8.2 R30.1 U1.3(I1P)
IBN: C18.1 R37.1 U1.6(I2N)
IBP: C17.2 R34.1 U1.5(I2P)
ICN: C20.1 R41.1 U1.8(I3N)
ICP: C19.2 R38.1 U1.7(I3P)
IRQ0: U1.30(IRQ0) U3.1(A)
IRQ1: U1.31(IRQ1) U4.1(A)
NCS: R67.1 U7.14(VOA)
PHASE-A: J3.1(PHASE_A) R1.2
PHASE-B: J3.2(PHASE_A) R10.2 RL1.3
PHASE-C: J3.3(PHASE_A) R19.2
PM0: J1.1 R29.2 U1.33(PM0)
PM1: J2.1 R66.2 U1.34(PM1)
SCK: R68.1 U7.13(VOB)
SDI: R69.1 U7.12(VOC)
SDO: R70.1 U7.11(VID)
VAN: C2.2 R9.1 U1.14(V1N)
VAP: C1.2 R7.1 R8.1 U1.13(V1P)
VBN: C4.2 R18.1 U1.16(V2N)
VBP: C3.2 R16.1 R17.1 U1.15(V2P)
VCN: C6.2 R27.1 U1.18(V3N)
VCP: C5.2 R25.1 R26.1 U1.17(V3P)
WARNOUT: U1.29(WARNOUT) U21.1(A)
NetC13_2: C13.2 C14.2 U1.42(VDD18) U1.43(VDD18)
NetC15_2: C15.2 C16.2 U1.11(VREF)
NetD10_1: D10.1(A) Q1.3 RL1.5(COIL)
NetJ3_4: J3.4(NEUTRAL) RL1.4(NC)
NetJ7_1: J7.1 R40.2 R41.2
NetJ7_2: J7.2 R38.2 R39.1
NetJ7_3: J7.3 R36.2 R37.2
NetJ7_4: J7.4 R34.2 R35.1
NetJ7_5: J7.5 R32.2 R33.2
NetJ7_6: J7.6 R30.2 R31.1
NetLED1_2: LED1.2 R50.1
NetLED2_2: LED2.2 R51.1
NetLED3_2: LED3.2 R52.1
NetLED4_2: LED4.2 R53.1
NetQ1_1: Q1.1 R42.1 ; port MODE_SEL
NetR1_1: R1.1 R2.2
NetR2_1: R2.1 R3.2
NetR3_1: R3.1 R4.2
NetR4_1: R4.1 R5.2
NetR5_1: R5.1 R6.2
NetR6_1: R6.1 R7.2
NetR10_1: R10.1 R11.2
NetR11_1: R11.1 R12.2
NetR12_1: R12.1 R13.2
NetR13_1: R13.1 R14.2
NetR14_1: R14.1 R15.2
NetR15_1: R15.1 R16.2
NetR19_1: R19.1 R20.2
NetR20_1: R20.1 R21.2
NetR21_1: R21.1 R22.2
NetR22_1: R22.1 R23.2
NetR23_1: R23.1 R24.2
NetR24_1: R24.1 R25.2
NetR60_2: R60.2 U3.2(K)
NetR61_1: R61.1 U3.3(E) ; port IRQ1
NetR62_2: R62.2 U4.2(K)
NetR63_1: R63.1 U4.3(E) ; port IRQ2
NetR64_2: R64.2 U21.2(K)
NetR65_1: R65.1 U21.3(E) ; port WARNOUT
NetR67_2: R67.2 U1.37(~{CS})
NetR68_2: R68.2 U1.38(SCLK)
NetR69_2: R69.2 U1.40(SDI)
NetR70_2: R70.2 U1.39(SDO)
NetU1_20: U1.20(OSCI) X1.2
NetU1_21: U1.21(OSCO) X1.1
NetU5_31: U7.3(VIA) ; port ATM_CS

Not connected (* = marked no-connect by the designer): U1 22(ZX0)* 23(ZX1)* 24(ZX2)*

### Layout directives
net class HV_SIG: DVDD33, IAN, IAP, IBN, IBP, ICN, ICP, Neutral, VAN, VAP, VBN, VBP, VCN, VCP

### Notes on the sheet
- Project:
- Sheet title:
- Sheet
- of
- Design by:
- Document No:
- Size:
- A3
- Checked by:
- Revision:
- Date:

### Library data of the parts
C1-C20 C38-C42 C89 C93 C94 = CN: PN: *; LCSC: *
  C1-C6 C8 C9 C17-C20: Value: 18nF
  C7 C10 C11 C13 C15 C39 C41 C42 C89 C93 C94: Value: 100nF
  C12 C14 C40: Value: 10uF
  C16: Value: 4.7uF
  C38: Value: 1uF
D10 = Diode SMD: Default Diode; LCSC: *; PN: *; Value: M7
J1 J2 = CNT: DNP; PN: DNP; LCSC: DNP
  J1: Value: PM0
  J2: Value: PM1
J3 = KF7.62-4: Value: PHASEA
J7 = KF5.08-6: ComponentLink1 Description: Manufacturer; ComponentLink2 Description: Datasheet; Manufacturer: *; ComponentLink1URL: http://www.we-online.com; ComponentLink2URL: http://katalog.we-online.de/em/datasheet/6911031100xx.pdf; LCSC: *; PN: *; Value: KF6
LED1-LED4 = LED SMD: PN: *; LCSC: *; Value: GREEN
Q1 = FET-N: PN: *; LCSC: *; Value: SI2308
R1-R42 R50-R53 R60-R70 = Res-SMD: Resistor; PN: *; LCSC: *
  R1-R7 R10-R16 R19-R25: Value: 240k
  R8 R9 R17 R18 R26 R27 R30 R33 R34 R37 R38 R41 R50-R53 R60 R62 R64: Value: 1k
  R28 R29 R42 R61 R63 R65 R66: Value: 10k
  R31 R32 R35 R36 R39 R40: Value: 2.2R
  R67-R70: Value: 22R
RL1 = Relay 5: Relay SPDT,10A - 12VDC 5 Pin; PN: G5Q-14 DC24; LCSC: C397242; Value: G5Q-14 DC24
U1 = ATM90E32AS: PN: ATM90E32AS-AU-R; LCSC: C177153; Value: ATM90E32AS
U3 U4 U21 = OPTO: DC Phototransistor; PN: EL3H7(C)(TA)-G; LCSC: C92243; Value: EL3H7
U7 = ADUM1401: -40℃~+125℃ 1 100ns 1Mbps 2.7V~5.5V 2.7V~5.5V 2500 25kV/us 3 SOIC-16-300mil Digital Isolators ROHS; PN: ADUM1401ARWZ; LCSC: C579384; Value: ADUM1401ARWZ
U10 = LM1117: 800mA Low-Dropout Linear Regulator; PN: LM1117MPX-3.3/NOPB; LCSC: C9662; Value: LM1117-3.3V
X1 = XT2: LCSC: *; PN: *; Value: 16.384MHz

## Sheet Power Supply.SchDoc
size 420 x 297 mm; CheckedBy: Bao Bui Q.; Engineer: Hung Nguyen D.; Revision: 1.0.0; SheetNumber: 2; SheetTotal: 6
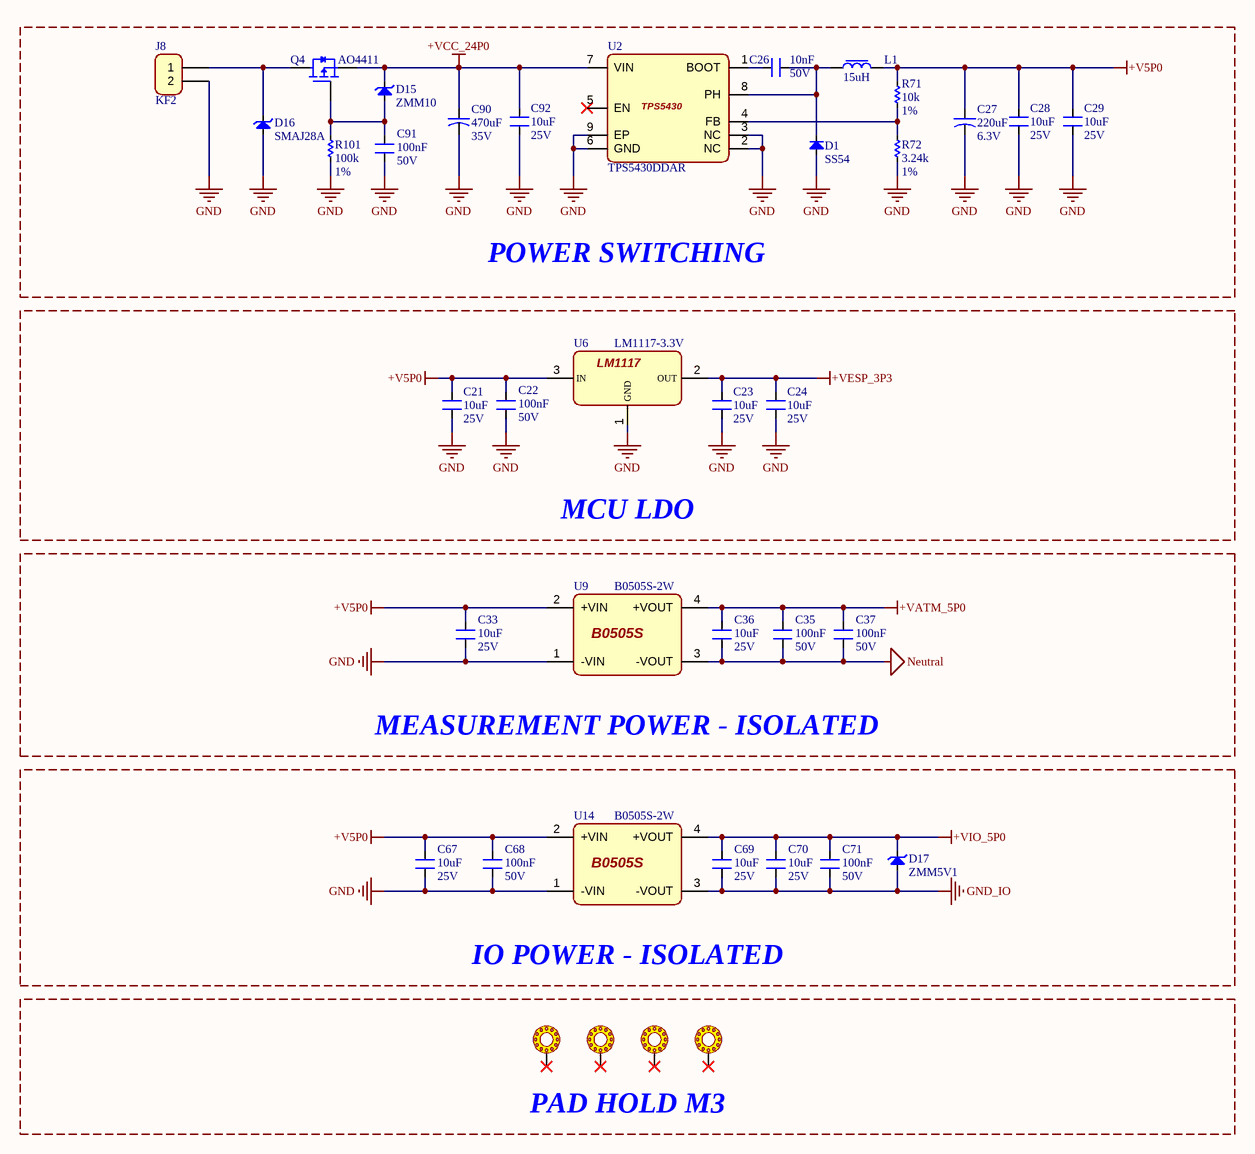
[diagram p4: Power Supply.SchDoc]

### Parts
C21  Rating: 25V  [CAP_SMD_1206]  (hidden comment: 10uF)
C22  Rating: 50V  [CAP_SMD_1206]  (hidden comment: 100nF)
C23  Rating: 25V  [CAP_SMD_1206]  (hidden comment: 10uF)
C24  Rating: 25V  [CAP_SMD_1206]  (hidden comment: 10uF)
C26  Rating: 50V  [CAP_SMD_0603]  (hidden comment: 10nF)
C27  Rating: 6.3V  [TANT 2312]  (hidden comment: 220uF)
C28  Rating: 25V  [CAP_SMD_1206]  (hidden comment: 10uF)
C29  Rating: 25V  [CAP_SMD_1206]  (hidden comment: 10uF)
C33  Rating: 25V  [CAP_SMD_1206]  (hidden comment: 10uF)
C35  Rating: 50V  [CAP_SMD_1206]  (hidden comment: 100nF)
C36  Rating: 25V  [CAP_SMD_1206]  (hidden comment: 10uF)
C37  Rating: 50V  [CAP_SMD_1206]  (hidden comment: 100nF)
C67  Rating: 25V  [CAP_SMD_0805]  (hidden comment: 10uF)
C68  Rating: 50V  [CAP_SMD_0805]  (hidden comment: 100nF)
C69  Rating: 25V  [CAP_SMD_1206]  (hidden comment: 10uF)
C70  Rating: 25V  [CAP_SMD_1206]  (hidden comment: 10uF)
C71  Rating: 50V  [CAP_SMD_1206]  (hidden comment: 100nF)
C90  Rating: 35V  [CAP_ALU_10x10.2]  (hidden comment: 470uF)
C91  Rating: 50V  [CAP_SMD_0603]  (hidden comment: 100nF)
C92  Rating: 25V  [CAP_SMD_1206]  (hidden comment: 10uF)
D1  SS54  [DIO-SMD-A]
D15  ZMM10  [SOD-80]
D16  SMAJ28A  [DIO-SMD-A]
D17  ZMM5V1  [SOD-80]
H1  HOLD  [M3-VIA]  (value not drawn)
H2  HOLD  [M3-VIA]  (value not drawn)
H3  HOLD  [M3-VIA]  (value not drawn)
H4  HOLD  [M3-VIA]  (value not drawn)
J8  KF2  [KF2-5.08X]
L1  15uH  [SRP7030]
Q4  AO4411  [FET-SOIC-8]
R71  Tolerance: 1%  [RES_SMD_0603]  (hidden comment: 10k)
R72  Tolerance: 1%  [RES_SMD_0603]  (hidden comment: 3.24k)
R101  Tolerance: 1%  [RES_SMD_0603]  (hidden comment: 100k)
U2  TPS5430DDAR  [SOIC-8-EP]
U6  LM1117-3.3V  [SOT223-4]
U9  B0505S-2W  [SIP,19.6x7mm]
U14  B0505S-2W  [SIP,19.6x7mm]

### Blocks framed on the sheet
POWER SWITCHING: C26-C29 C90-C92 D1 D15 D16 J8 L1 Q4 R71 R72 R101 U2
MCU LDO: C21-C24 U6
MEASUREMENT POWER - ISOLATED: C33 C35-C37 U9
IO POWER - ISOLATED: C67-C71 D17 U14
PAD HOLD M3: H1-H4

### Nets
+V5P0: C21.1 C22.2 C27.1 C28.1 C29.1 C33.2 C67.2 C68.2 L1.2 R71.2 U6.3(IN) U9.2(+VIN) U14.2(+VIN)
+VATM_5P0: C35.2 C36.2 C37.2 U9.4(+VOUT)
+VCC_24P0: C90.1 C92.1 D15.2(K) Q4.2 U2.7(VIN)
+VESP_3P3: C23.1 C24.1 U6.2(OUT)
+VIO_5P0: C69.2 C70.2 C71.2 D17.2(K) U14.4(+VOUT)
GND: C21.2 C22.1 C23.2 C24.2 C27.2 C28.2 C29.2 C33.1 C67.1 C68.1 C90.2 C91.1 C92.2 D1.1(A) D16.1(A) J8.2 R72.1 R101.1 U2.2(NC) U2.3(NC) U2.6(GND) U2.9(EP) U6.1(GND) U9.1(-VIN) U14.1(-VIN)
GND_IO: C69.1 C70.1 C71.1 D17.1(A) U14.3(-VOUT)
Neutral: C35.1 C36.1 C37.1 U9.3(-VOUT)
NetC26_1: C26.1 D1.2(K) L1.1 U2.8(PH)
NetC26_2: C26.2 U2.1(BOOT)
NetC91_2: C91.2 D15.1(A) Q4.1 R101.2
NetD16_2: D16.2(K) J8.1 Q4.3
NetR71_1: R71.1 R72.2 U2.4(FB)

Not connected (* = marked no-connect by the designer): H1 1*; H2 1*; H3 1*; H4 1*; U2 5(EN)*

### Notes on the sheet
- Project:
- Sheet title:
- Sheet
- of
- Design by:
- Document No:
- Size:
- A3
- Checked by:
- Revision:
- Date:

### Library data of the parts
C21-C24 C26 C28 C29 C33 C35-C37 C67-C71 C91 C92 = CN: PN: *; LCSC: *
  C21 C23 C24 C28 C29 C33 C36 C67 C69 C70 C92: Value: 10uF
  C22 C35 C37 C68 C71 C91: Value: 100nF
  C26: Value: 10nF
C27 = CN-TANTALUM: LCSC: *; PN: *; Value: 220uF
C90 = CN-ALU-SMD: Polarized Capacitor (Axial); LCSC: *; PN: *; Value: 470uF
D1 = Diode SMD: Default Diode; LCSC: C22452; PN: SS54; Value: SS54
D15 = DIODE Zener: Zenner; PN: ZMM10; LCSC: C181070; Value: ZMM10
D16 = TVS DIODE: PN: *; LCSC: *; Value: SMAJ28A
D17 = DIODE Zener: Zenner; PN: ZMM10; LCSC: C181070; Value: ZMM5V1
H1-H4 = PAD_HOLD
J8 = KF2: ComponentLink1 Description: Manufacturer; ComponentLink2 Description: Datasheet; Manufacturer: *; ComponentLink1URL: http://www.we-online.com; ComponentLink2URL: http://katalog.we-online.de/em/datasheet/6911031100xx.pdf; LCSC: *; PN: *; Value: KF2
L1 = INDUCTOR: PN: MDA7030-150M; LCSC: C2847486; Value: 15uH
Q4 = FET-P: PN: *; LCSC: *; Value: AO4411
R71 R72 R101 = Res-SMD: Resistor; PN: *; LCSC: *
  R71: Value: 10k
  R72: Value: 3.24k
  R101: Value: 100k
U2 = TPS5430: -40℃~+125℃@(TJ) 1 1.221V~32.04V 3A 4.4mA 5.5V~36V 500kHz Adjustable Buck Buck Built-in No SOIC-8-EP DC-DC Converters ROHS; LCSC: C9864; PN: TPS5430DDAR; Value: TPS5430DDAR
U6 = LM1117: as U10 on sheet Poly Phase Metering; LCSC: C9662; Value: LM1117-3.3V
U9 U14 = B0505S: -40℃~+85℃ 1 1.5kV 100kHz 2W 4.5V~5.5V 400mA 5V 75mVp-p 84% Short Circuit Protection SIP,19.6x7mm Isolated Power Modules ROHS; LCSC: C387593; PN: B0505S-2W; Value: B0505S-2W

## Sheet Core.SchDoc
size 420 x 297 mm; CheckedBy: Bao Bui Q.; Engineer: Hung Nguyen D.; Revision: 1.0.0; SheetNumber: 4; SheetTotal: 6
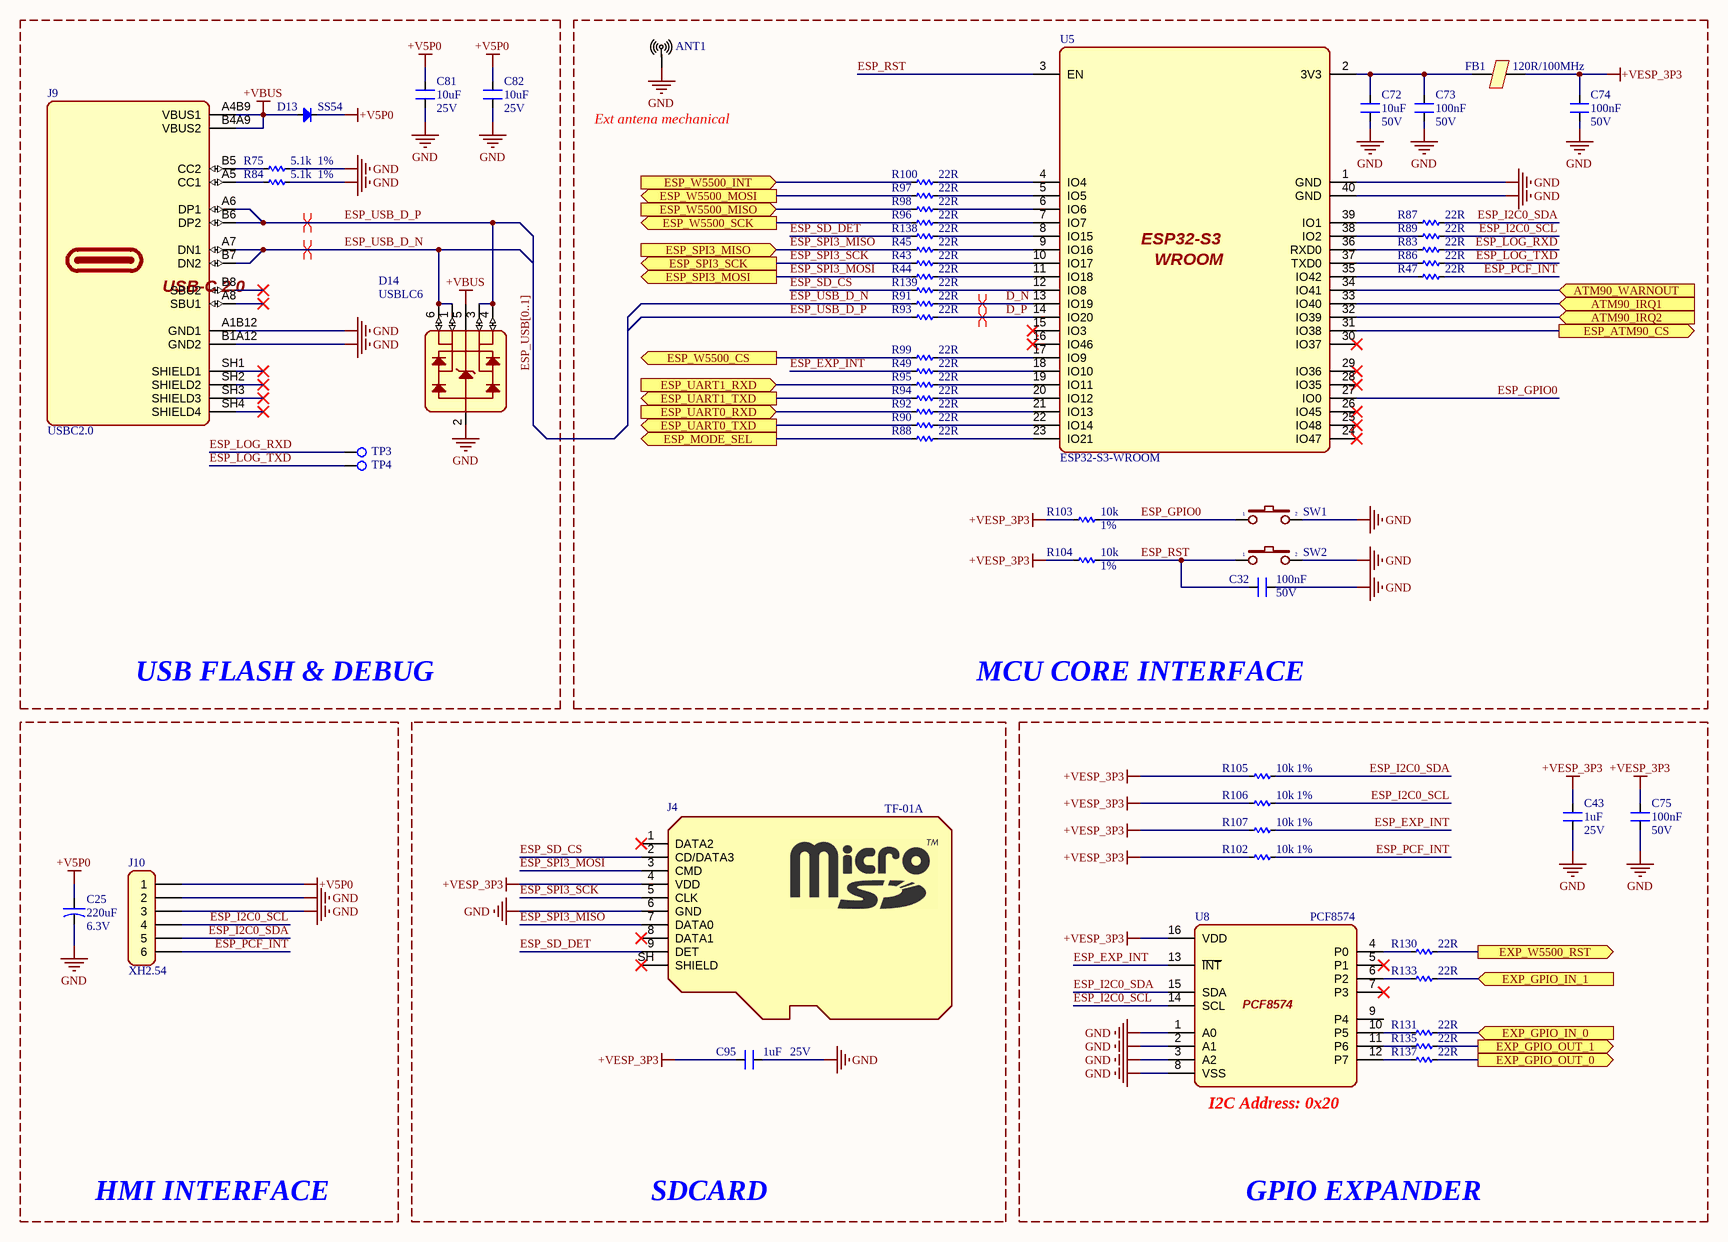
[diagram p5: Core.SchDoc]

### Parts
ANT1  Anten  [SMA-8.5mm]  (value not drawn)
C25  Rating: 6.3V  [TANT 2312]  (hidden comment: 220uF)
C32  Rating: 50V  [CAP_SMD_0603]  (hidden comment: 100nF)
C43  Rating: 25V  [CAP_SMD_0603]  (hidden comment: 1uF)
C72  Rating: 50V  [CAP_SMD_0805]  (hidden comment: 10uF)
C73  Rating: 50V  [CAP_SMD_0805]  (hidden comment: 100nF)
C74  Rating: 50V  [CAP_SMD_0805]  (hidden comment: 100nF)
C75  Rating: 50V  [CAP_SMD_0603]  (hidden comment: 100nF)
C81  Rating: 25V  [CAP_SMD_0603]  (hidden comment: 10uF)
C82  Rating: 25V  [CAP_SMD_0603]  (hidden comment: 10uF)
C95  Rating: 25V  [CAP_SMD_0603]  (hidden comment: 1uF)
D13  SS54  [DIO-SMD-A]
D14  USBLC6  [SOT23-6]
FB1  120R/100MHz  [Ferrite-0805]
J4  TF-01A  [TF-01A]
J9  USBC2.0  [MOLEX-2171790001]
J10  XH2.54  [XH2.54-6P-TH]
R43  22R  [RES_SMD_0603]
R44  22R  [RES_SMD_0603]
R45  22R  [RES_SMD_0603]
R47  22R  [RES_SMD_0603]
R49  22R  [RES_SMD_0603]
R75  Tolerance: 1%  [RES_SMD_0603]  (hidden comment: 5.1k)
R83  22R  [RES_SMD_0603]
R84  Tolerance: 1%  [RES_SMD_0603]  (hidden comment: 5.1k)
R86  22R  [RES_SMD_0603]
R87  22R  [RES_SMD_0603]
R88  22R  [RES_SMD_0603]
R89  22R  [RES_SMD_0603]
R90  22R  [RES_SMD_0603]
R91  22R  [RES_SMD_0603]
R92  22R  [RES_SMD_0603]
R93  22R  [RES_SMD_0603]
R94  22R  [RES_SMD_0603]
R95  22R  [RES_SMD_0603]
R96  22R  [RES_SMD_0603]
R97  22R  [RES_SMD_0603]
R98  22R  [RES_SMD_0603]
R99  22R  [RES_SMD_0603]
R100  22R  [RES_SMD_0603]
R102  Tolerance: 1%  [RES_SMD_0603]  (hidden comment: 10k)
R103  Tolerance: 1%  [RES_SMD_0603]  (hidden comment: 10k)
R104  Tolerance: 1%  [RES_SMD_0603]  (hidden comment: 10k)
R105  Tolerance: 1%  [RES_SMD_0603]  (hidden comment: 10k)
R106  Tolerance: 1%  [RES_SMD_0603]  (hidden comment: 10k)
R107  Tolerance: 1%  [RES_SMD_0603]  (hidden comment: 10k)
R130  22R  [RES_SMD_0603]
R131  22R  [RES_SMD_0603]
R133  22R  [RES_SMD_0603]
R135  22R  [RES_SMD_0603]
R137  22R  [RES_SMD_0603]
R138  22R  [RES_SMD_0603]
R139  22R  [RES_SMD_0603]
SW1  SW2  [SW1-SMD]  (value not drawn)
SW2  SW2  [SW2-r-6x6mm]  (value not drawn)
TP3  Test_Point  [PAD-SMD-D2.0]  (value not drawn)
TP4  Test_Point  [PAD-SMD-D2.0]  (value not drawn)
U5  ESP32-S3-WROOM  [ESP32-S3-WROOM-1U-N16R8]
U8  PCF8574  [SOIC-16-300mil]

### Blocks framed on the sheet
USB FLASH & DEBUG: C81 C82 D13 D14 J9 R75 R84 TP3 TP4
MCU CORE INTERFACE: ANT1 C32 C72-C74 FB1 R43-R45 R47 R49 R83 R86-R100 R103 R104 R138 R139 SW1 SW2 U5
HMI INTERFACE: C25 J10
SDCARD: C95 J4
GPIO EXPANDER: C43 C75 R102 R105-R107 R130 R131 R133 R135 R137 U8

### Ports
ATM90_IRQ1 (in, see Architecture[3B]), ATM90_IRQ2 (in, see Architecture[3B]), ATM90_WARNOUT (in, see Architecture[3B]), ESP_ATM90_CS (out, see Architecture[3A]), ESP_MODE_SEL (out, see Architecture[3A]), ESP_SPI3_MISO (in, see Architecture[3A]), ESP_SPI3_MOSI (out, see Architecture[3A]), ESP_SPI3_SCK (out, see Architecture[3A]), ESP_UART0_RXD (in, see Architecture[4B]), ESP_UART0_TXD (out, see Architecture[4B]), ESP_UART1_RXD (in, see Architecture[4B]), ESP_UART1_TXD (out, see Architecture[4B]), ESP_W5500_CS (out, see Architecture[4A]), ESP_W5500_INT (in, see Architecture[4A]), ESP_W5500_MISO (in, see Architecture[4A]), ESP_W5500_MOSI (out, see Architecture[4A]), ESP_W5500_SCK (out, see Architecture[4A]), EXP_GPIO_IN_0 (in, see Architecture[4B]), EXP_GPIO_IN_1 (in, see Architecture[4B]), EXP_GPIO_OUT_0 (out, see Architecture[4B]), EXP_GPIO_OUT_1 (out, see Architecture[4B]), EXP_W5500_RST (out, see Architecture[4A])

### Nets
+V5P0: C25.1 C81.1 C82.1 D13.2(K) J10.1
+VBUS: D13.1(A) D14.5(VBUS) J9.A4B9(VBUS1) J9.B4A9(VBUS2)
+VESP_3P3: C43.1 C74.1 C75.1 C95.1 FB1.2 J4.4(VDD) R102.1 R103.1 R104.1 R105.1 R106.1 R107.1 U8.16(VDD)
GND: ANT1.MP(GND) C25.2 C32.1 C43.2 C72.2 C73.2 C74.2 C75.2 C81.2 C82.2 C95.2 D14.2(GND) J4.6(GND) J9.A1B12(GND1) J9.B1A12(GND2) J10.2 J10.3 R75.2 R84.2 SW1.2 SW2.2 U5.1(GND) U5.40(GND) U8.1(A0) U8.2(A1) U8.3(A2) U8.8(VSS)
D_N: R91.1 U5.13(IO19)
D_P: R93.1 U5.14(IO20)
ESP_EXP_INT: R49.2 R107.2 U8.13(~{INT})
ESP_GPIO0: R103.2 SW1.1 U5.27(IO0)
ESP_I2C0_SCL: J10.4 R89.1 R106.2 U8.14(SCL)
ESP_I2C0_SDA: J10.5 R87.1 R105.2 U8.15(SDA)
ESP_LOG_RXD: R83.1 TP3.1
ESP_LOG_TXD: R86.1 TP4.1
ESP_PCF_INT: J10.6 R47.1 R102.2
ESP_RST: C32.2 R104.2 SW2.1 U5.3(EN)
ESP_SD_CS: J4.2(CD/DATA3) R139.2
ESP_SD_DET: J4.9(DET) R138.2
ESP_SPI3_MISO: J4.7(DATA0) R45.2 ; port ESP_SPI3_MISO
ESP_SPI3_MOSI: J4.3(CMD) R44.2 ; port ESP_SPI3_MOSI
ESP_SPI3_SCK: J4.5(CLK) R43.2 ; port ESP_SPI3_SCK
ESP_USB_D_N: D14.1(I/O1_IN) D14.6(I/O1_OUT) J9.A7(DN1) J9.B7(DN2) R91.2
ESP_USB_D_P: D14.3(I/O2_IN) D14.4(I/O2_OUT) J9.A6(DP1) J9.B6(DP2) R93.2
W5500_RST: R130.1 ; port EXP_W5500_RST
NetC72_1: C72.1 C73.1 FB1.1 U5.2(3V3)
NetJ9_A5: J9.A5(CC1) R84.1
NetJ9_B5: J9.B5(CC2) R75.1
NetQ1_1: R88.1 ; port ESP_MODE_SEL
NetQ2_1: R137.1 ; port EXP_GPIO_OUT_0
NetQ3_1: R135.1 ; port EXP_GPIO_OUT_1
NetR43_1: R43.1 U5.10(IO17)
NetR44_1: R44.1 U5.11(IO18)
NetR45_1: R45.1 U5.9(IO16)
NetR47_2: R47.2 U5.35(IO42)
NetR49_1: R49.1 U5.18(IO10)
NetR61_1: U5.33(IO40) ; port ATM90_IRQ1
NetR63_1: U5.32(IO39) ; port ATM90_IRQ2
NetR65_1: U5.34(IO41) ; port ATM90_WARNOUT
NetR83_2: R83.2 U5.36(RXD0)
NetR86_2: R86.2 U5.37(TXD0)
NetR87_2: R87.2 U5.39(IO1)
NetR88_2: R88.2 U5.23(IO21)
NetR89_2: R89.2 U5.38(IO2)
NetR90_1: R90.1 ; port ESP_UART0_TXD
NetR90_2: R90.2 U5.22(IO14)
NetR92_1: R92.1 ; port ESP_UART0_RXD
NetR92_2: R92.2 U5.21(IO13)
NetR94_1: R94.1 ; port ESP_UART1_TXD
NetR94_2: R94.2 U5.20(IO12)
NetR95_1: R95.1 ; port ESP_UART1_RXD
NetR95_2: R95.2 U5.19(IO11)
NetR96_1: R96.1 U5.7(IO7)
NetR96_2: R96.2 ; port ESP_W5500_SCK
NetR97_1: R97.1 U5.5(IO5)
NetR97_2: R97.2 ; port ESP_W5500_MOSI
NetR98_1: R98.1 U5.6(IO6)
NetR98_2: R98.2 ; port ESP_W5500_MISO
NetR99_1: R99.1 U5.17(IO9)
NetR99_2: R99.2 ; port ESP_W5500_CS
NetR100_1: R100.1 U5.4(IO4)
NetR100_2: R100.2 ; port ESP_W5500_INT
NetR123_1: R131.1 ; port EXP_GPIO_IN_0
NetR126_1: R133.1 ; port EXP_GPIO_IN_1
NetR130_2: R130.2 U8.4(P0)
NetR131_2: R131.2 U8.10(P5)
NetR133_2: R133.2 U8.6(P2)
NetR135_2: R135.2 U8.11(P6)
NetR137_2: R137.2 U8.12(P7)
NetR138_1: R138.1 U5.8(IO15)
NetR139_1: R139.1 U5.12(IO8)
NetU5_31: U5.31(IO38) ; port ESP_ATM90_CS

Not connected (* = marked no-connect by the designer): J4 1(DATA2)* 8(DATA1)* SH(SHIELD)*; J9 A8(SBU1)* B8(SBU2)* SH1(SHIELD1)* SH2(SHIELD2)* SH3(SHIELD3)* SH4(SHIELD4)*; U5 15(IO3)* 16(IO46)* 24(IO47)* 25(IO48)* 26(IO45)* 28(IO35)* 29(IO36)* 30(IO37)*; U8 5(P1)* 7(P3)* 9(P4)

### Buses and harness runs
bus ESP_USB[0..1]

### Layout directives
differential pair; differential pair class USB 90R: D_N, D_P, ESP_USB_D_N, ESP_USB_D_P

### Notes on the sheet
- Ext antena mechanical
- (near U8) I2C Address: 0x20
- Project:
- Sheet title:
- Sheet
- of
- Design by:
- Document No:
- Size:
- A3
- Checked by:
- Revision:
- Date:
- (in symbol ESP32-S3-WROOM) ESP32-S3; WROOM
- (in symbol USBC-2.0) USB-C 2.0

### Library data of the parts
ANT1 = Anten Mechanical
C25 = CN-TANTALUM: LCSC: *; PN: *; Value: 220uF
C32 C43 C72-C75 C81 C82 C95 = CN: PN: *; LCSC: *
  C32 C73-C75: Value: 100nF
  C43 C95: Value: 1uF
  C72 C81 C82: Value: 10uF
D13 = Diode SMD: Default Diode; LCSC: C22452; PN: SS54; Value: SS54
D14 = USBLC6: TVS DIODE 5.25VWM 17VC SOT23-6
FB1 = FERRITE BEAD: PN: CBW201209U121T; LCSC: C139186; Value: 120R/100MHz
J4 = SD_Socket: PN: Partnum?; LCSC: JLCPart?; Value: TF-01A
J9 = USBC-2.0: USB Type C - Connector, Top-mount SMT, 16pos | Molex Incorporated 217179-0001; PN: 2171790001; LCSC: C3197684; Value: USBC2.0
J10 = Header6: ComponentLink1 Description: Manufacturer; ComponentLink2 Description: Datasheet; ComponentLink1URL: http://www.we-online.com; ComponentLink2URL: http://katalog.we-online.de/em/datasheet/6130xx143121.pdf; PN: *; LCSC: *; Value: XH2.54
R43-R45 R47 R49 R83 R86-R100 R130 R131 R133 R135 R137-R139 = Res-SMD: Resistor; Tolerance: 1%; PN: *; LCSC: *; Value: 22R
R75 R84 R102-R107 = Res-SMD: Resistor; PN: *; LCSC: *
  R75 R84: Value: 5.1k
  R102-R107: Value: 10k
SW1 SW2 = SW2: Switch button 2 pin; PN: B3U-3000P; LCSC: C963349; Value: SW2
U5 = ESP32-S3-WROOM: -103.5dBm -40℃~+65℃ 2.4GHz 20.5dBm 355mA 3V~3.6V 95mA ESP32-S3R8 On-board PCB Antenna UART、SPI、I2C、GPIO、I2S、USB SMD,25.5x18mm WiFi Modules ROHS; PN: ESP32-S3-WROOM-1-N16R8; LCSC: C2913202; Value: ESP32-S3-WROOM
U8 = PCF8574: -40℃~+85℃ 100kHz 10mA 16 2.5V~6V 2.5uA 30uA 8 I2C Interrupt Output Reset function、Cascading and address extension、Built-in LED driver SOIC-16-300mil I/O Expanders ROHS; PN: PCF8574T/3,518; LCSC: C7605; Value: PCF8574

## Nets that join several sheets
+V5P0: Power Supply (13 pins), Core (5 pins)
+VATM_5P0: Poly Phase Metering (C38.2 C39.2 C41.2 U10.3), Power Supply (C35.2 C36.2 C37.2 U9.4)
+VCC_24P0: Peripheral (D11.2 D12.2 RL2.1 RL3.1), Poly Phase Metering (D10.2 RL1.1), Power Supply (5 pins)
+VESP_3P3: Network (C47.1 FB2.1 R128.1), Peripheral (6 pins), Poly Phase Metering (6 pins), Power Supply (C23.1 C24.1 U6.2), Core (13 pins)
+VIO_5P0: Peripheral (18 pins), Power Supply (5 pins)
GND: Network (35 pins), Peripheral (10 pins), Poly Phase Metering (8 pins), Power Supply (25 pins), Core (27 pins)
GND_IO: Peripheral (20 pins), Power Supply (5 pins)
Neutral: Poly Phase Metering (61 pins), Power Supply (C35.1 C36.1 C37.1 U9.3)
ESP_SPI3_MISO: Poly Phase Metering (U7.6), Core (J4.7 R45.2)
ESP_SPI3_MOSI: Poly Phase Metering (U7.5), Core (J4.3 R44.2)
ESP_SPI3_SCK: Poly Phase Metering (U7.4), Core (J4.5 R43.2)
NetQ1_1: Poly Phase Metering (Q1.1 R42.1), Core (R88.1)
NetQ2_1: Peripheral (Q2.1 R124.1), Core (R137.1)
NetQ3_1: Peripheral (Q3.1 R127.1), Core (R135.1)
NetR61_1: Poly Phase Metering (R61.1 U3.3), Core (U5.33)
NetR63_1: Poly Phase Metering (R63.1 U4.3), Core (U5.32)
NetR65_1: Poly Phase Metering (R65.1 U21.3), Core (U5.34)
NetR90_1: Peripheral (U20.3), Core (R90.1)
NetR92_1: Peripheral (U20.2), Core (R92.1)
NetR94_1: Peripheral (U19.3), Core (R94.1)
NetR95_1: Peripheral (U19.2), Core (R95.1)
NetR96_2: Network (U12.33), Core (R96.2)
NetR97_2: Network (U12.35), Core (R97.2)
NetR98_2: Network (U12.34), Core (R98.2)
NetR99_2: Network (U12.32), Core (R99.2)
NetR100_2: Network (U12.36), Core (R100.2)
NetR123_1: Peripheral (R123.1 U11.4), Core (R131.1)
NetR126_1: Peripheral (R126.1 U13.4), Core (R133.1)
NetU5_31: Poly Phase Metering (U7.3), Core (U5.31)
W5500_RST: Network (C44.2 R73.2 U12.37), Core (R130.1)